# Altium project AIO_3399J_Schematic.PrjPcb (part 1 of 5)
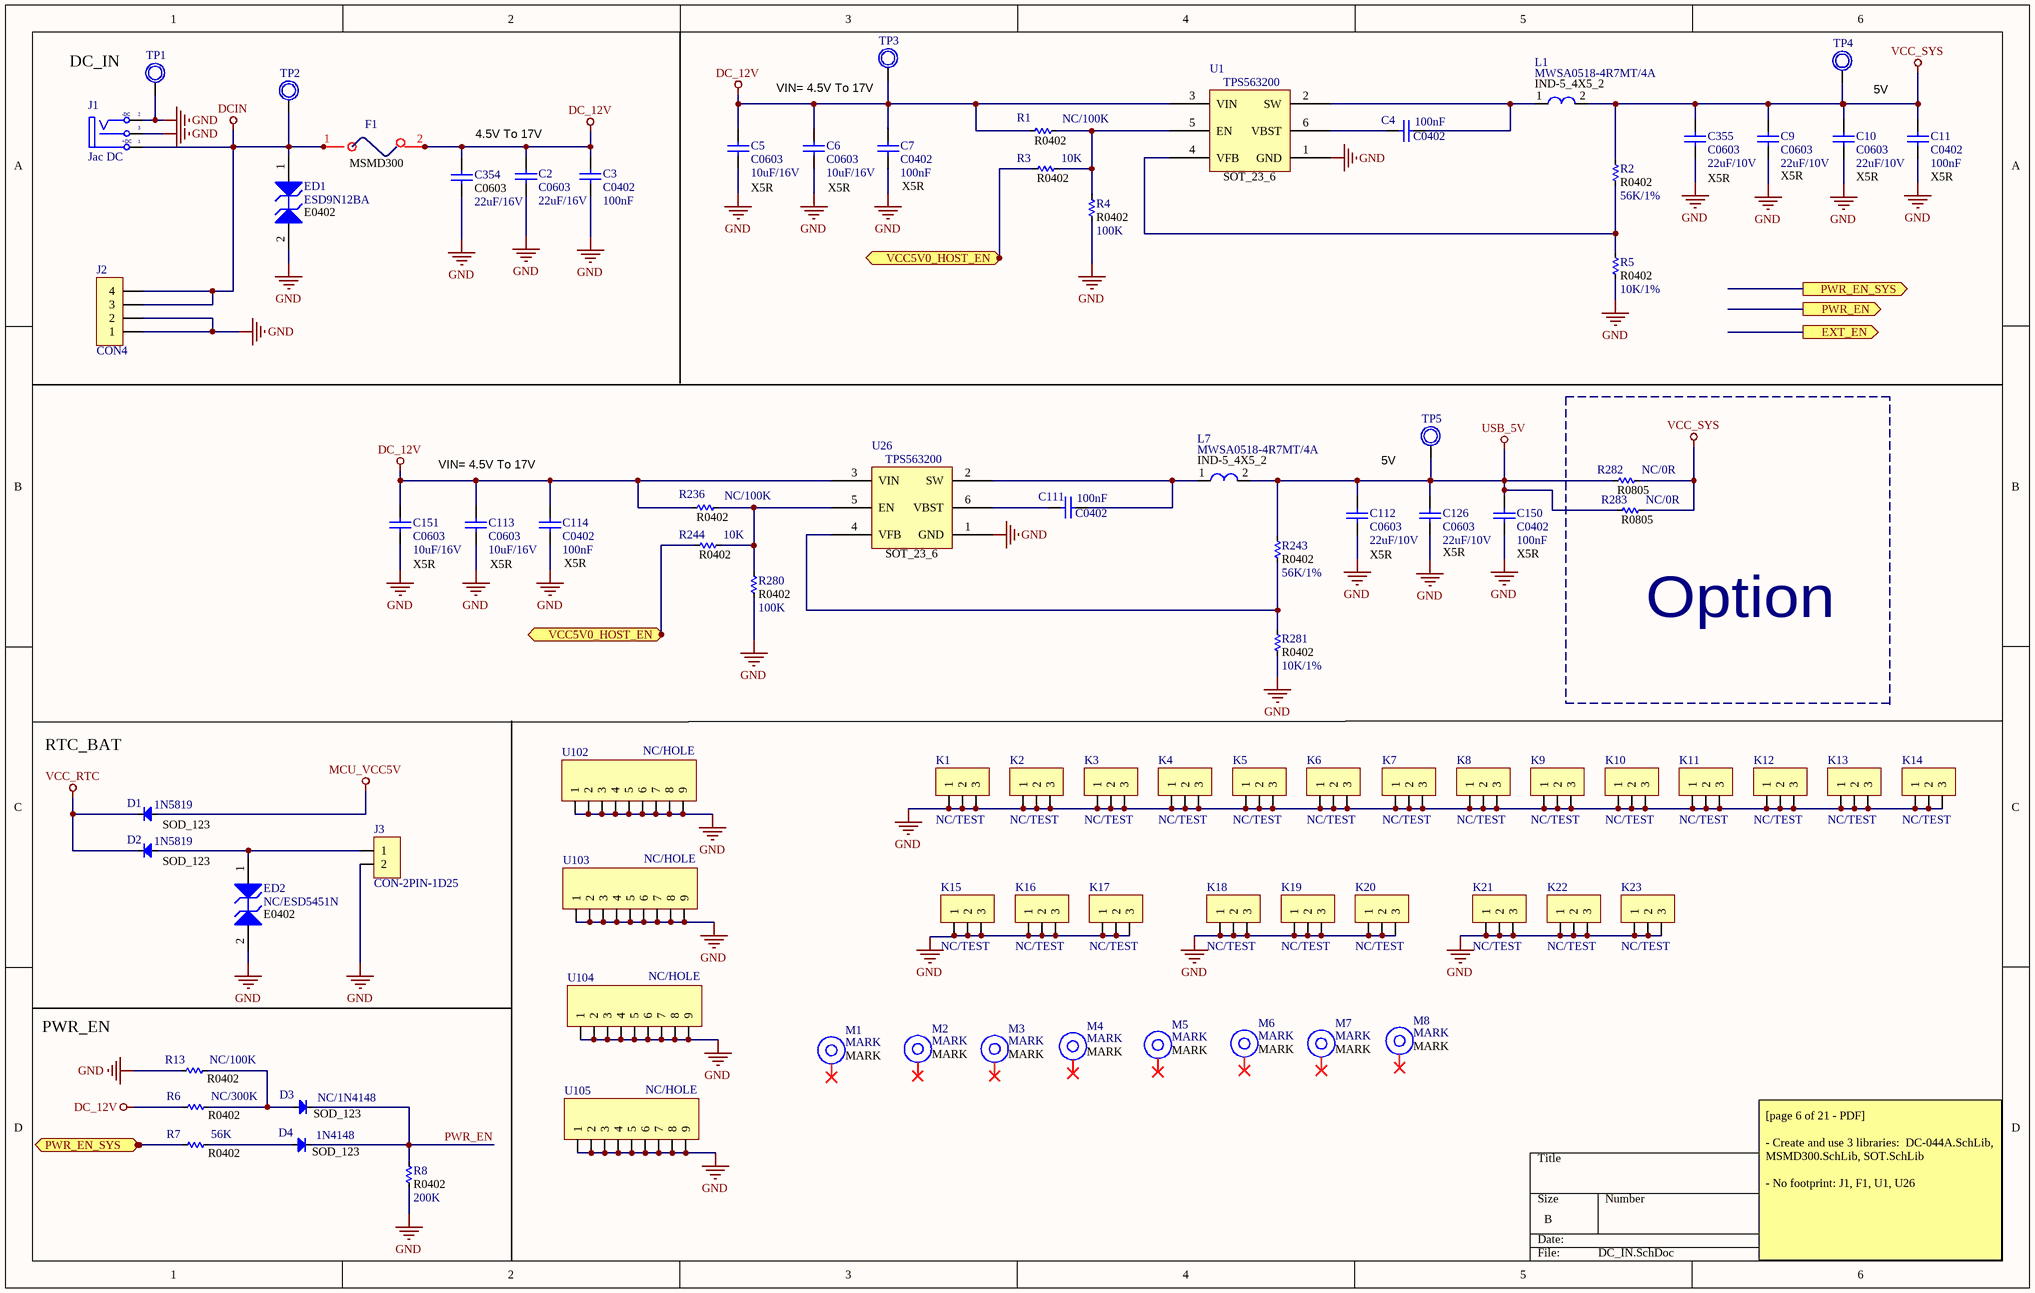
[diagram p0: DC_IN.SchDoc]
16 sheets, 1037 parts. Net scope: flat (ports and power ports of the same name join across sheets).
Board file: PCB1.PcbDoc
Sheets:
  DC_IN.SchDoc
  MCU-TFCARD.SchDoc
  SPI_UART.SchDoc
  MXM_Connector.SchDoc
  MIPI_Panel.SchDoc
  HOST_PORT-USB2.0.SchDoc
  TYPE_CO-USB3.0.SchDoc
  HDMI_OUT.SchDoc
  HDMI_IN.SchDoc
  AUDIO_CODEC.SchDoc
  WIFI.SchDoc
  RJ45.SchDoc
  FAN.SchDoc
  3G4G.SchDoc
  CAMERA.SchDoc
  eDP.SchDoc

## Sheet DC_IN.SchDoc
size B

### Parts
C2  C0603  value 22uF/16V  [C 0603]
C3  C0402  value 100nF  [C 0402]
C4  C0402  value 100nF  [C 0402]
C5  C0603  value 10uF/16V  [C 0603]
C6  C0603  value 10uF/16V  [C 0603]
C7  C0402  value 100nF  [C 0402]
C9  C0603  value 22uF/10V  [C 0603]
C10  C0603  value 22uF/10V  [C 0603]
C11  C0402  value 100nF  [C 0402]
C111  C0402  value 100nF  [C 0402]
C112  C0603  value 22uF/10V  [C 0603]
C113  C0603  value 10uF/16V  [C 0603]
C114  C0402  value 100nF  [C 0402]
C126  C0603  value 22uF/10V  [C 0603]
C150  C0402  value 100nF  [C 0402]
C151  C0603  value 10uF/16V  [C 0603]
C354  C0603  value 22uF/16V  [C 0603]
C355  C0603  value 22uF/10V  [C 0603]
D1  value 1N5819  typr: SOD_123  [DIO-SMD-123]  (hidden comment: Diode SMD)
D2  value 1N5819  typr: SOD_123  [DIO-SMD-123]  (hidden comment: Diode SMD)
D3  value NC/1N4148  typr: SOD_123  [DIO-SMD-123]  (hidden comment: Diode SMD)
D4  value 1N4148  typr: SOD_123  [DIO-SMD-123]  (hidden comment: Diode SMD)
ED1  ESD9N12BA  size: E0402  [DFN1006-2L]
ED2  NC/ESD5451N  size: E0402  [DFN1006-2L]
F1  mSMD300  [MSMD300/3A]  (value not drawn)
J1  Jac DC  [DC-IN]
J2  CON4  [CON4]
J3  CON-2PIN-1D25  [Header2]
K1  NC/TEST  [KTest]
K2  NC/TEST  [KTest]
K3  NC/TEST  [KTest]
K4  NC/TEST  [KTest]
K5  NC/TEST  [KTest]
K6  NC/TEST  [KTest]
K7  NC/TEST  [KTest]
K8  NC/TEST  [KTest]
K9  NC/TEST  [KTest]
K10  NC/TEST  [KTest]
K11  NC/TEST  [KTest]
K12  NC/TEST  [KTest]
K13  NC/TEST  [KTest]
K14  NC/TEST  [KTest]
K15  NC/TEST  [KTest]
K16  NC/TEST  [KTest]
K17  NC/TEST  [KTest]
K18  NC/TEST  [KTest]
K19  NC/TEST  [KTest]
K20  NC/TEST  [KTest]
K21  NC/TEST  [KTest]
K22  NC/TEST  [KTest]
K23  NC/TEST  [KTest]
L1  MWSA0518-4R7MT/4A  [L-SMD-M-7.3x4.5]
L7  MWSA0518-4R7MT/4A  [L-SMD-M-7.3x4.5]
M1  MARK  (value not drawn)
M2  MARK  (value not drawn)
M3  MARK  (value not drawn)
M4  MARK  (value not drawn)
M5  MARK  (value not drawn)
M6  MARK  (value not drawn)
M7  MARK  (value not drawn)
M8  MARK  (value not drawn)
R1  R0402  value NC/100K  [R 0402]
R2  R0402  value 56K/1%  [R 0402]
R3  R0402  value 10K  [R 0402]
R4  R0402  value 100K  [R 0402]
R5  R0402  value 10K/1%  [R 0402]
R6  R0402  value NC/300K  [R 0402]
R7  R0402  value 56K  [R 0402]
R8  R0402  value 200K  [R 0402]
R13  R0402  value NC/100K  [R 0402]
R236  R0402  value NC/100K  [R 0402]
R243  R0402  value 56K/1%  [R 0402]
R244  R0402  value 10K  [R 0402]
R280  R0402  value 100K  [R 0402]
R281  R0402  value 10K/1%  [R 0402]
R282  R0805  value NC/0R  [R 0805]
R283  R0805  value NC/0R  [R 0805]
TP1  TP  [TP1]  (value not drawn)
TP2  TP  [TP1]  (value not drawn)
TP3  TP  [TP1]  (value not drawn)
TP4  TP  [TP1]  (value not drawn)
TP5  TP  [TP1]  (value not drawn)
U1  SOT-23-6_TPS563200  [SOT-23-6]  (value not drawn)
U26  SOT-23-6_TPS563200  [SOT-23-6]  (value not drawn)
U102  NC/HOLE  [JP9-C1T]
U103  NC/HOLE  [JP9-C1T]
U104  NC/HOLE  [JP9-C1T]
U105  NC/HOLE  [JP9-C1T]

### Blocks framed on the sheet
Option: R282 R283

### Ports
EXT_EN (out), PWR_EN (out), PWR_EN_SYS (in), PWR_EN_SYS (out), VCC5V0_HOST_EN (in)

### Nets
DC_12V: C2.2 C3.2 C5.2 C6.2 C7.2 C113.2 C114.2 C151.2 C354.2 F1.2 R1.2 R6.2 R236.2 TP3.1 U1.3(VIN) U26.3(VIN)
DCIN: ED1.1(A1) F1.1 J1.1(T) J2.3 J2.4 TP2.1
GND: C2.1 C3.1 C5.1 C6.1 C7.1 C9.1 C10.1 C11.1 C112.1 C113.1 C114.1 C126.1 C150.1 C151.1 C354.1 C355.1 ED1.2(A2) ED2.2(A2) J1.2(TN) J1.3(S) J2.1 J2.2 J3.2 K1.1 K1.2 K1.3 K2.1 K2.2 K2.3 K3.1 K3.2 K3.3 K4.1 K4.2 K4.3 K5.1 K5.2 K5.3 K6.1 K6.2 K6.3 K7.1 K7.2 K7.3 K8.1 K8.2 K8.3 K9.1 K9.2 K9.3 K10.1 K10.2 K10.3 K11.1 K11.2 K11.3 K12.1 K12.2 K12.3 K13.1 K13.2 K13.3 K14.1 K14.2 K14.3 K15.1 K15.2 K15.3 K16.1 K16.2 K16.3 K17.1 K17.2 K17.3 K18.1 K18.2 K18.3 K19.1 K19.2 K19.3 K20.1 K20.2 K20.3 K21.1 K21.2 K21.3 K22.1 K22.2 K22.3 K23.1 K23.2 K23.3 R4.1 R5.2 R8.2 R13.2 R280.1 R281.2 TP1.1 U1.1(GND) U26.1(GND) U102.1 U102.2 U102.3 U102.4 U102.5 U102.6 U102.7 U102.8 U102.9 U103.1 U103.2 U103.3 U103.4 U103.5 U103.6 U103.7 U103.8 U103.9 U104.1 U104.2 U104.3 U104.4 U104.5 U104.6 U104.7 U104.8 U104.9 U105.1 U105.2 U105.3 U105.4 U105.5 U105.6 U105.7 U105.8 U105.9
MCU_VCC5V: D1.1(A)
USB_5V: C112.2 C126.2 C150.2 L7.2 R243.2 R282.2 R283.2 TP5.1
VCC_RTC: D1.2(K) D2.2(K)
VCC_SYS: C9.2 C10.2 C11.2 C355.2 L1.2 R2.2 R282.1 R283.1 TP4.1
PWR_EN: D3.2(K) D4.2(K) R8.1
NetC4_1: C4.1 L1.1 U1.2(SW)
NetC4_2: C4.2 U1.6(VBST)
NetC111_1: C111.1 L7.1 U26.2(SW)
NetC111_2: C111.2 U26.6(VBST)
NetD2_1: D2.1(A) ED2.1(A1) J3.1
NetD3_1: D3.1(A) R6.1 R13.1
NetD4_1: D4.1(A) R7.1
NetR1_1: R1.1 R3.1 R4.2 U1.5(EN)
NetR2_1: R2.1 R5.1 U1.4(VFB)
NetR7_2: R7.2 ; port PWR_EN_SYS
NetR236_1: R236.1 R244.1 R280.2 U26.5(EN)
NetR243_1: R243.1 R281.1 U26.4(VFB)

Not connected (* = marked no-connect by the designer): M1 52*; M2 52*; M3 52*; M4 52*; M5 52*; M6 52*; M7 52*; M8 52*; R3 2; R244 2

### Notes on the sheet
- (near TP1) DC_IN
- (near TP3) VIN= 4.5V To 17V
- 5V
- 4.5V To 17V
- VIN= 4.5V To 17V
- (near TP5) 5V
- (near D1) RTC_BAT
- (near R13) PWR_EN
- [page 6 of 21 - PDF]
  - Create and use 3 libraries:  DC-044A.SchLib, MSMD300.SchLib, SOT.SchLib
  - No footprint: J1, F1, U1, U26
- (in symbol Cap) X5R
- (in symbol DCIN) -DC; +DC
- (in symbol L-SMD-1) IND-5_4X5_2
- (in symbol mSMD300) MSMD300
- (in symbol SOT-23-6_TPS563200) SOT_23_6

### Library data of the parts
C2-C7 C9-C11 C111-C114 C126 C150 C151 C354 C355 = Cap: Capacitor; Published: 8-Jun-2000; LatestRevisionDate: 17-Jul-2002; LatestRevisionNote: Re-released for DXP Platform.; PackageReference: RAD-0.3; Publisher: Altium Limited; PackageDescription: Radial Cap, Thru-Hole; 2 Leads; 0.3 in Pin Spacing
D1-D4 = Diode SMD: Default Diode; Code - JEDEC: DO-214-AB; Published: 8-Jun-2000; Revision: July-2002: Re-released for DXP Platform.; Publisher: Altium Limited
ED1 ED2 = 1SMB54CAT3: 600 W Peak Power Zener Transient Voltage Suppressor, Bidirectional, 2-Pin SMB, Tape and Reel; Manufacturer: On Semiconductor; IR Max (uA): 5; PPK Max (W): 600; V(BR) Typ (V): 63.16; DatasheetVersion: Rev. A; PackageVersion: Rev. A, 01/2000; PackageReference: SMB-2-403C-01; PackageDescription: 2-Pin Small Molded Package, J-Bend Lead, Body 4.315 x 3.555 mm; Supplier 1: Digi-Key; Supplier Part Number 1: 1SMB54CAT3-ND; Direction: Bidirectional; Packing: Tape and Reel; Mounting Technology: Surface Mount; PartNumber: 1SMB54CAT3; ComponentLink1Description: Manufacturer URL; ComponentLink1URL: http://www.onsemi.com/; ComponentLink2Description: Datasheet; ComponentLink2URL: http://www.onsemi.com/pub_link/Collateral/1SMB10CAT3-D.PDF; ComponentLink3Description: Package Specification; ComponentLink3URL: http://www.onsemi.com/pub_link/Collateral/1SMB10CAT3-D.PDF
J1 = DCIN: Jac DC input; Value: Jac DC
J2 = JP4x1-2.0: WR-PHD 2.00 mm Socket Header; Manufacturer: W¨¹rth Elektronik eiSos GmbH; partNo: 62000411821; ComponentLink1 Description: Manufacturer; ComponentLink2 Description: Datasheet; NoPins: 04; Created Date: 2 April 2013; ComponentLink1URL: http://www.we-online.com; ComponentLink2URL: http://katalog.we-online.de/em/datasheet/6200xx11821.pdf; Created by: Karrer Zheng
J3 = JP2: WR-PHD 2.54 mm Angled Socket Header; Manufacturer: W¨¹rth Elektronik eiSos GmbH; partNo: 613002143121; ComponentLink1 Description: Manufacturer; ComponentLink2 Description: Datasheet; NoPins: 02; Created Date: 29 March 2013; ComponentLink1URL: http://www.we-online.com; ComponentLink2URL: http://katalog.we-online.de/em/datasheet/6130xx143121.pdf; Created by: Karrer Zheng
K1-K23 = JP3: WR-PHD 2.54 mm Angled Socket Header; Manufacturer: W¨¹rth Elektronik eiSos GmbH; partNo: 613003143121; ComponentLink1 Description: Manufacturer; ComponentLink2 Description: Datasheet; NoPins: 03; Created Date: 29 March 2013; ComponentLink1URL: http://www.we-online.com; ComponentLink2URL: http://katalog.we-online.de/em/datasheet/6130xx143121.pdf; Created by: Karrer Zheng
L1 L7 = L-SMD-1: partNo: 78477010; Manufacturer: Wurth Elektronik; Inductance: 1.0 μH; ComponentLink1Description: Manufacturer; ComponentLink1URL: http://www.we-online.de; Created by: Baojun Chen; Created Date: Nov.2015; ComponentLink2Description: Datasheet; ComponentLink2URL: http://katalog.we-online.de/pbs/datasheet/78477010.pdf
R1-R8 R13 R236 R243 R244 R280-R283 = Res-SMD: Resistor; Manufacturer: Generic Components; Class: Passive; Published: 08/06/2000; Publisher: Altium Hobart Technology Centre
TP1-TP5 = TP1: Test Point; Value: Test Point
U1 U26 = SOT-23-6_TPS563200: Switching Voltage Regulators 17 Vin,3A Sync SD Reg; Manufacturer: Texas Instruments; Manufacturer Part Number: TPS563200DDCR; Operating Supply Current: 190 uA; Supplier 1: Mouser; RoHS: RoHS Compliant; Category: Switching Voltage Regulators; Stock 1: 18637; Pricing 1: 1=1.44, 10=1.23, 100=0.947, 500=0.836, 1000=0.660, 3000=0.586, 9000=0.564 (USD); Height: 1.1 mm; Length: 2.9 mm; Operating Temperature Range: - 40 C to + 125 C; Package / Case: SOT-23-Thin-6; Packaging: Cut Tape; Series: TPS563200; Width: 1.6 mm; Brand: Texas Instruments; Mounting Style: SMD/SMT; Maximum Operating Temperature: + 125 C; Minimum Operating Temperature: - 40 C; Product Type: Switching Voltage Regulators; Standard Pack Qty: 3000; Subcategory: PMIC - Power Management ICs; RoHS - Mouser: Y; Minimum Order Quantity: 1; Reeling: True
U102-U105 = JP9: WR-PHD 2.54 mm Angled Socket Header; Manufacturer: W¨¹rth Elektronik eiSos GmbH; partNo: 613009143121; ComponentLink1 Description: Manufacturer; ComponentLink2 Description: Datasheet; NoPins: 09; Created Date: 29 March 2013; ComponentLink1URL: http://www.we-online.com; ComponentLink2URL: http://katalog.we-online.de/em/datasheet/6130xx143121.pdf; Created by: Karrer Zheng

## Sheet MCU-TFCARD.SchDoc
size B
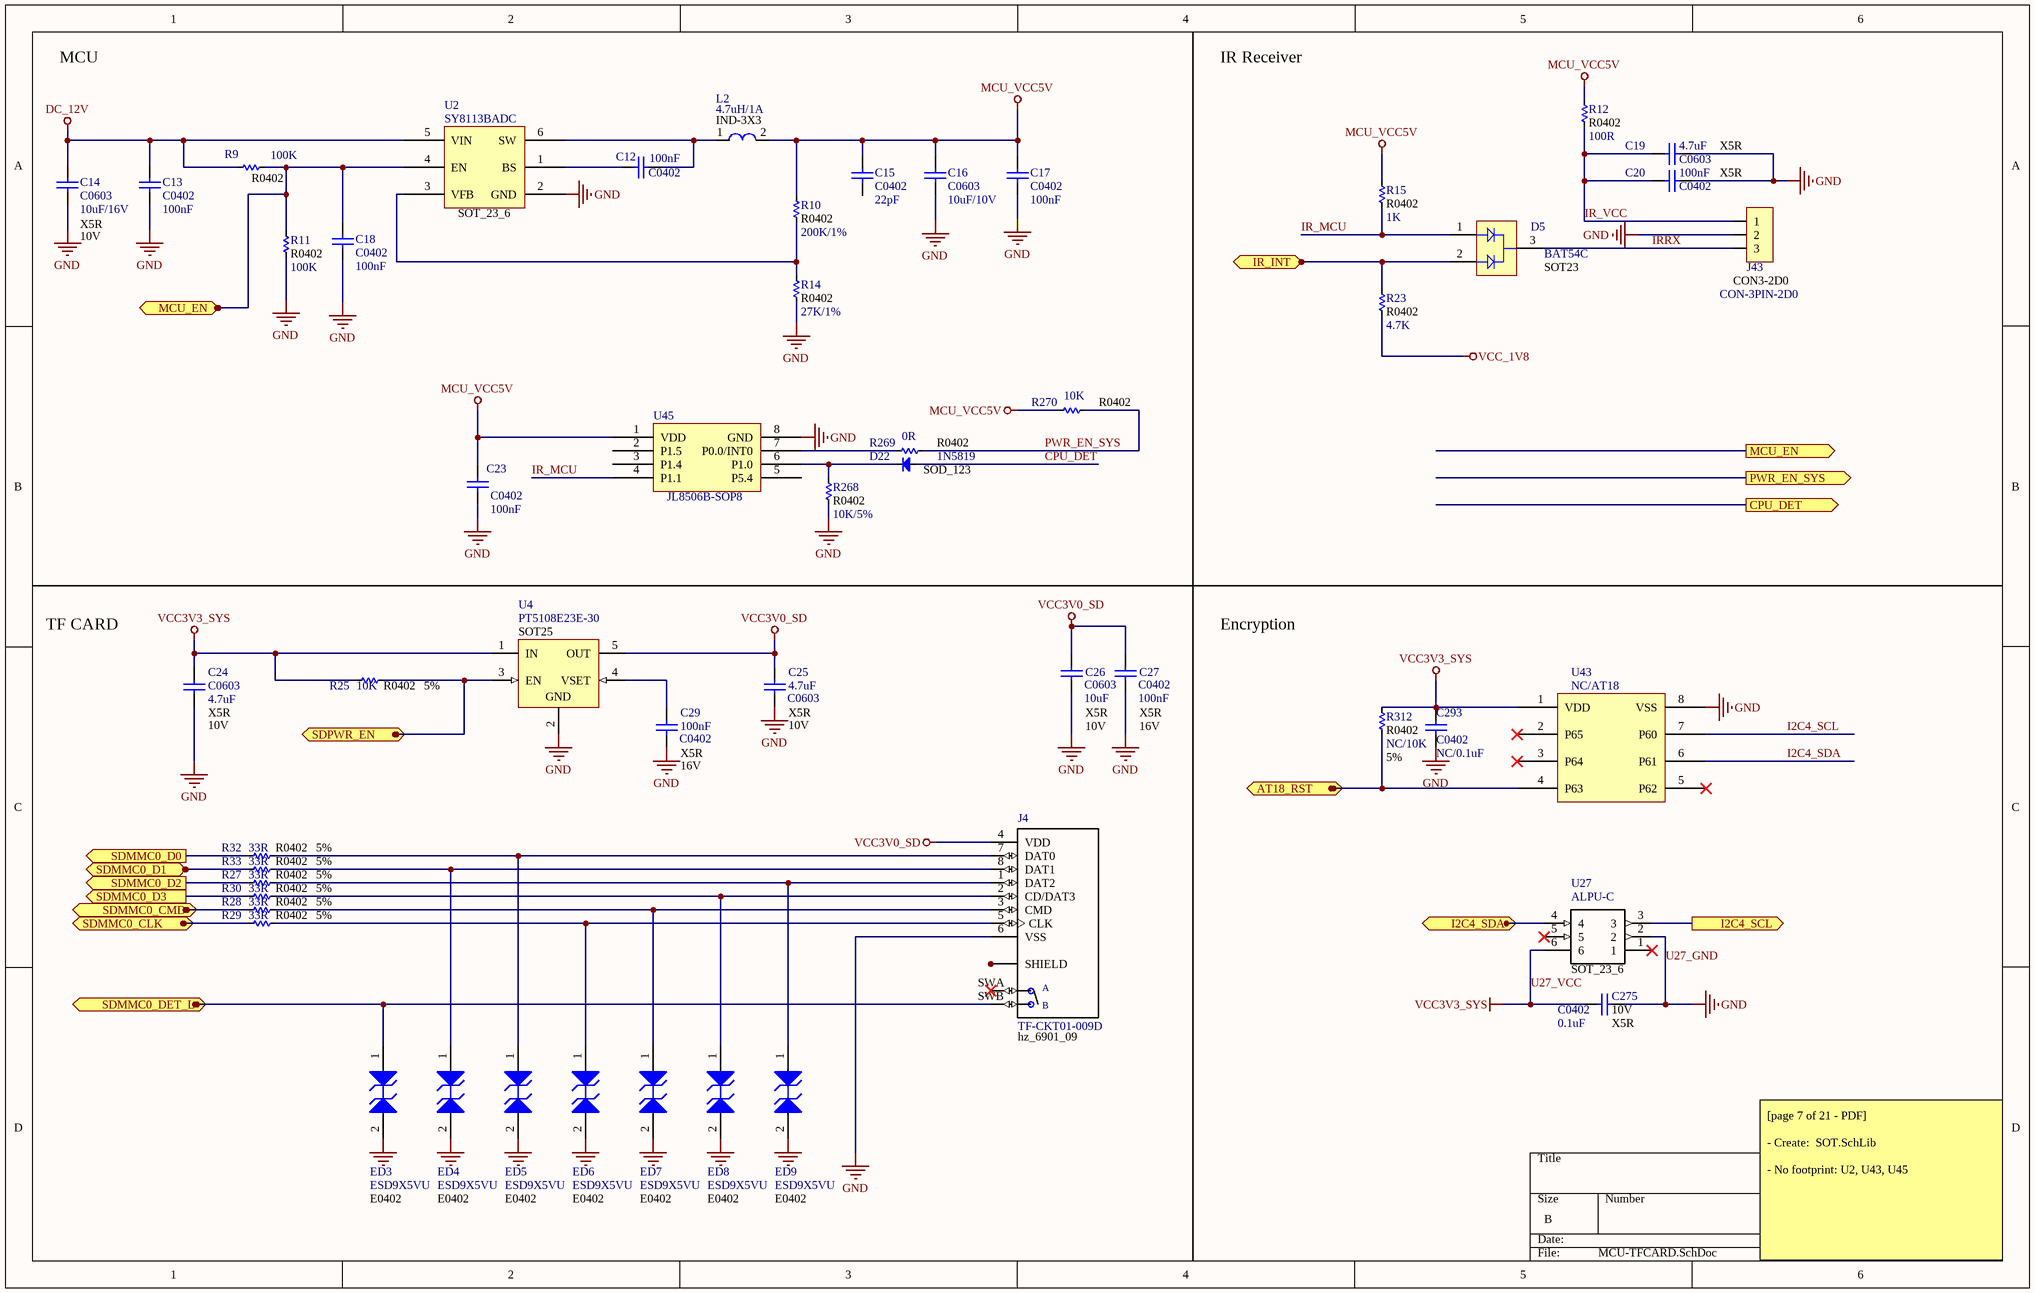
[diagram p1: MCU-TFCARD.SchDoc]

### Parts
C12  C0402  value 100nF  [C 0402]
C13  C0402  value 100nF  [C 0402]
C14  C0603  value 10uF/16V  [C 0603]
C15  C0402  value 22pF  [C 0402]
C16  C0603  value 10uF/10V  [C 0603]
C17  C0402  value 100nF  [C 0402]
C18  C0402  value 100nF  [C 0402]
C19  C0603  value 4.7uF  [C 0603]
C20  C0402  value 100nF  [C 0402]
C23  C0402  value 100nF  [C 0402]
C24  C0603  value 4.7uF  [C 0603]
C25  C0603  value 4.7uF  [C 0603]
C26  C0603  value 10uF  [C 0603]
C27  C0402  value 100nF  [C 0402]
C29  C0402  value 100nF  [C 0402]
C275  C0402  value 0.1uF  [C 0402]
C293  C0402  value NC/0.1uF  [C 0402]
D5  BAT54C  [INF-SOT23_N]
D22  value 1N5819  typr: SOD_123  [DIO-SMD-123]  (hidden comment: Diode SMD)
ED3  ESD9X5VU  size: E0402  [DFN1006-2L]
ED4  ESD9X5VU  size: E0402  [DFN1006-2L]
ED5  ESD9X5VU  size: E0402  [DFN1006-2L]
ED6  ESD9X5VU  size: E0402  [DFN1006-2L]
ED7  ESD9X5VU  size: E0402  [DFN1006-2L]
ED8  ESD9X5VU  size: E0402  [DFN1006-2L]
ED9  ESD9X5VU  size: E0402  [DFN1006-2L]
J4  TF-CKT01-009D  [*HRS_DM3AT-SF-PEJM5_DM3AT-SF-PEJM5(Primary)]
J43  CON-3PIN-2D0  [CON3]
L2  4.7uH/1A  [L-SMD-M-7.3x4.5]
R9  R0402  value 100K  [R 0402]
R10  R0402  value 200K/1%  [R 0402]
R11  R0402  value 100K  [R 0402]
R12  R0402  value 100R  [R 0402]
R14  R0402  value 27K/1%  [R 0402]
R15  R0402  value 1K  [R 0402]
R23  R0402  value 4.7K  [R 0402]
R25  R0402  value 10K  [R 0402]
R27  R0402  value 33R  [R 0402]
R28  R0402  value 33R  [R 0402]
R29  R0402  value 33R  [R 0402]
R30  R0402  value 33R  [R 0402]
R32  R0402  value 33R  [R 0402]
R33  R0402  value 33R  [R 0402]
R268  R0402  value 10K/5%  [R 0402]
R269  R0402  value 0R  [R 0402]
R270  R0402  value 10K  [R 0402]
R312  R0402  value NC/10K  [R 0402]
U2  SOT-23-6_SY8113BADC  [SOT-23-6 Thin]  (value not drawn)
U4  PT5108E23E-30  [TI-DDC5_N]
U27  ALPU-C  [*SSOT6]
U43  NC/AT18  [SOP-8]
U45  SOP-8_JL8506B  [SOP-8]  (value not drawn)

### Ports
AT18_RST (in), CPU_DET (out), I2C4_SCL (out), I2C4_SDA (out), IR_INT (out), MCU_EN (in), MCU_EN (out), PWR_EN_SYS (out), SDMMC0_CLK (out), SDMMC0_CMD (out), SDMMC0_D0 (out), SDMMC0_D1 (out), SDMMC0_D2 (out), SDMMC0_D3 (out), SDMMC0_DET_L (out), SDPWR_EN (in)

### Nets
DC_12V: C13.2 C14.2 R9.2 U2.5(VIN)
GND: C13.1 C14.1 C16.1 C17.1 C18.1 C19.1 C20.1 C23.1 C24.1 C25.1 C26.1 C27.1 C29.1 C275.2 C293.1 ED3.2(A2) ED4.2(A2) ED5.2(A2) ED6.2(A2) ED7.2(A2) ED8.2(A2) ED9.2(A2) J4.6(VSS) J43.2 R11.1 R14.2 R268.2 U2.2(GND) U4.2(GND) U27.2 U43.8(VSS) U45.8(GND)  [also labelled U27_GND]
MCU_VCC5V: C15.2 C16.2 C17.2 C23.2 L2.2 R10.2 R12.1 R15.1 R270.1 U45.1(VDD)
U27_VCC: C24.2 C275.1 C293.2 R25.1 R312.2 U4.1(IN) U27.6 U43.1(VDD)  [also labelled VCC3V3_SYS]
VCC3V0_SD: C25.2 C26.2 C27.2 J4.4(VDD) U4.5(OUT)
VCC_1V8: R23.2
CPU_DET: D22.1(A)
I2C4_SCL: U27.3 ; port I2C4_SCL
I2C4_SCL: U43.7(P60)  [a separate net that carries the same name]
I2C4_SDA: U27.4 ; port I2C4_SDA
I2C4_SDA: U43.6(P61)  [a separate net that carries the same name]
IR_INT: D5.2(A2) R23.1 ; port IR_INT
IR_MCU: D5.1(A1) R15.2 U45.4(P1.1)
IR_VCC: C19.2 C20.2 J43.1 R12.2
IRRX: D5.3(K) J43.3
PWR_EN_SYS: R269.2 R270.2
SDMMC0_CLK: R29.1 ; port SDMMC0_CLK
SDMMC0_CMD: R28.1 ; port SDMMC0_CMD
SDMMC0_D0: R32.1 ; port SDMMC0_D0
SDMMC0_D1: R33.1 ; port SDMMC0_D1
SDMMC0_D2: R27.1 ; port SDMMC0_D2
SDMMC0_D3: R30.1 ; port SDMMC0_D3
SDMMC0_DET_L: ED3.1(A1) J4.SWB(B) ; port SDMMC0_DET_L
NetC12_1: C12.1 L2.1 U2.6(SW)
NetC12_2: C12.2 U2.1(BS)
NetC18_2: C18.2 R9.1 R11.2 U2.4(EN) ; port MCU_EN
NetC29_2: C29.2 U4.4(VSET)
NetD22_2: D22.2(K) R268.1 U45.6(P1.0)
NetED4_1: ED4.1(A1) J4.8(DAT1) R33.2
NetED5_1: ED5.1(A1) J4.7(DAT0) R32.2
NetED6_1: ED6.1(A1) J4.5(CLK) R29.2
NetED7_1: ED7.1(A1) J4.3(CMD) R28.2
NetED8_1: ED8.1(A1) J4.2(CD/DAT3) R30.2
NetED9_1: ED9.1(A1) J4.1(DAT2) R27.2
NetJ4_P1: J4.P1(SHIELD) J4.P2(SHIELD) J4.P3(SHIELD) J4.P4(SHIELD)
NetJ38_65: R312.1 U43.4(P63) ; port AT18_RST
NetJ38_165: R25.2 U4.3(EN) ; port SDPWR_EN
NetR10_1: R10.1 R14.1 U2.3(VFB)
NetR269_1: R269.1 U45.7(P0.0/INT0)

Not connected (* = marked no-connect by the designer): C15 1; J4 SWA(A)*; U27 1* 5*; U43 2(P65)* 3(P64)* 5(P62)*; U45 2(P1.5) 3(P1.4) 5(P5.4)

### Notes on the sheet
- MCU
- IR Receiver
- TF CARD
- Encryption
- [page 7 of 21 - PDF]
  - Create:  SOT.SchLib
  - No footprint: U2, U43, U45
- (in symbol Cap) X5R; 10V; 16V
- (in symbol DM3AT-SF-PEJM5) hz_6901_09
- (in symbol FDC6331L) SOT_23_6
- (in symbol JP3) CON3-2D0
- (in symbol L-SMD-1) IND-3X3
- (in symbol Res-SMD) 5%
- (in symbol SOP-8_JL8506B) JL8506B-SOP8
- (in symbol SOT-23-6_SY8113BADC) SY8113BADC; SOT_23_6
- (in symbol TPS781330220DDCTG4) SOT25

### Library data of the parts
C12-C20 C23-C27 C29 C275 C293 = Cap: Capacitor; Published: 8-Jun-2000; LatestRevisionDate: 17-Jul-2002; LatestRevisionNote: Re-released for DXP Platform.; PackageReference: RAD-0.3; Publisher: Altium Limited; PackageDescription: Radial Cap, Thru-Hole; 2 Leads; 0.3 in Pin Spacing
D5 = BAT54-05: Silicon Schottky Diode, SOT23, Reel, Green; Manufacturer: Infineon; Configuration: Dual; CT (max): 10 pF; Green: TRUE; IF (max): 200 mA; VF (max): 800 mV; VR (max): 30 V; PackageVersion: Apr-08; PackageReference: SOT23; PackageDescription: 3-Pin Small Outline Transistor Package, 1.3 x 2.9 mm Body, 0.95 mm Pitch; Supplier 1: Mouser; Supplier Part Number 1: N/A; Packing: Reel; Mounting Technology: Surface Mount; PartNumber: BAT54-05; ComponentLink1Description: Manufacturer URL; ComponentLink1URL: http://www.infineon.com/; ComponentLink2Description: Datasheet; ComponentLink2URL: http://www.infineon.com/dgdl/bat54series.pdf?folderId=db3a30431400ef68011425f1ca2505e3&fileId=db3a304314dca3890115190b74210ea6; ComponentLink3Description: Package Specification; ComponentLink3URL: http://www.infineon.com/dgdl/SOT23-Package_Overview.pdf?folderId=db3a30431936bc4b0119532290053c66&fileId=db3a30431936bc4b0119533468123c85
D22 = Diode SMD: Default Diode; Code - JEDEC: DO-214-AB; Published: 8-Jun-2000; Revision: July-2002: Re-released for DXP Platform.; Publisher: Altium Limited
ED3-ED9 = 1SMB54CAT3: as ED1 on sheet DC_IN; DatasheetVersion: Rev. A; PackageVersion: Rev. A, 01/2000; PackageReference: SMB-2-403C-01; PackageDescription: 2-Pin Small Molded Package, J-Bend Lead, Body 4.315 x 3.555 mm; Supplier 1: Digi-Key; Supplier Part Number 1: 1SMB54CAT3-ND; Direction: Bidirectional; Packing: Tape and Reel; Mounting Technology: Surface Mount; PartNumber: 1SMB54CAT3; ComponentLink1Description: Manufacturer URL; ComponentLink1URL: http://www.onsemi.com/; ComponentLink2Description: Datasheet; ComponentLink2URL: http://www.onsemi.com/pub_link/Collateral/1SMB10CAT3-D.PDF; ComponentLink3Description: Package Specification; ComponentLink3URL: http://www.onsemi.com/pub_link/Collateral/1SMB10CAT3-D.PDF
J4 = DM3AT-SF-PEJM5: DM3 RA SMT microSD memory card push/push; MF: Hirose; SnapEDA_Link: https://www.snapeda.com/parts/DM3AT-SF-PEJM5/Hirose%20Electric%20Co%20Ltd/view-part/?ref=snap; MP: DM3AT-SF-PEJM5; Package: None; Price: None; Availability: Unavailable; Value: *
J43 = JP3: as K1 on sheet DC_IN; Created Date: 29 March 2013; ComponentLink1URL: http://www.we-online.com; ComponentLink2URL: http://katalog.we-online.de/em/datasheet/6130xx143121.pdf; Created by: Karrer Zheng
L2 = L-SMD-1: as L1 on sheet DC_IN; ComponentLink1Description: Manufacturer; ComponentLink1URL: http://www.we-online.de; Created by: Baojun Chen; Created Date: Nov.2015; ComponentLink2Description: Datasheet; ComponentLink2URL: http://katalog.we-online.de/pbs/datasheet/78477010.pdf
R9-R12 R14 R15 R23 R25 R27-R30 R32 R33 R268-R270 R312 = Res-SMD: as R1 on sheet DC_IN; Published: 08/06/2000; Publisher: Altium Hobart Technology Centre
U2 = SOT-23-6_SY8113BADC: Switching Voltage Regulators 17 Vin,3A Sync SD Reg; Manufacturer: Texas Instruments; Manufacturer Part Number: TPS563200DDCR; Operating Supply Current: 190 uA; Supplier 1: Mouser; RoHS: RoHS Compliant; Category: Switching Voltage Regulators; Stock 1: 18637; Pricing 1: 1=1.44, 10=1.23, 100=0.947, 500=0.836, 1000=0.660, 3000=0.586, 9000=0.564 (USD); Height: 1.1 mm; Length: 2.9 mm; Operating Temperature Range: - 40 C to + 125 C; Package / Case: SOT-23-Thin-6; Packaging: Cut Tape; Series: TPS563200; Width: 1.6 mm; Brand: Texas Instruments; Mounting Style: SMD/SMT; Maximum Operating Temperature: + 125 C; Minimum Operating Temperature: - 40 C; Product Type: Switching Voltage Regulators; Standard Pack Qty: 3000; Subcategory: PMIC - Power Management ICs; RoHS - Mouser: Y; Minimum Order Quantity: 1; Reeling: True
U4 = TPS781330220DDCTG4: Single Output Dual Level Fixed LDO, 150 mA, Fixed 2.2, 3.3 V Output, 2.2 to 5.5 V Input, with Vset Pin, 5-pin SOT (DDC), -40 to 125 degC, Green (RoHS & no Sb/Br); Manufacturer: Texas Instruments; Accuracy(%): 3; Fixed Output Options(V): 3.3; Iout(Max)(A): 0.15; Iq(Typ)(mA): 0.001; SubFamily: Single Channel LDO; Vdo(Typ)(mV): 200; Vin(Max)(V): 5.5; Vin(Min)(V): 2.2; DatasheetVersion: SBVS102B; PackageVersion: 4204403-2/E; PackageReference: DDC5; PackageDescription: 5-Pin Plastic Small Outline, Body 2.9 x 1.6 mm, 0.95 mm Pitch; Supplier 1: Digi-Key; Supplier Part Number 1: TPS781330220DDCTG4-ND; Supplier 2: Mouser; Supplier Part Number 2: 595-S781330220DDCTG4; Eco-Plan: Green (RoHS & no Sb/Br); Vout Adj(Max)(V): 3.3; Vout Adj(Min)(V): 3.3; Mounting Technology: Surface Mount; Code_JEDEC: MO-193; PartNumber: TPS781330220DDCTG4; ComponentLink1Description: Manufacturer URL; ComponentLink1URL: http://www.ti.com/; ComponentLink2Description: Datasheet; ComponentLink2URL: http://www.ti.com/general/docs/lit/getliterature.tsp?genericPartNumber=TPS781330220&fileType=pdf; ComponentLink3Description: Package Specification; ComponentLink3URL: http://www.ti.com/litv/pdf/mpds123d
U27 = FDC6331L: FDC6331 Series 8 V 2.8 A High Side Integrated Load Switch - SSOT-6; MF: ON Semiconductor; Availability: Unavailable; Package: TSOT-23-6 ON Semiconductor; Price: None; SnapEDA_Link: https://www.snapeda.com/parts/FDC6331L/ON%20Semiconductor/view-part/?ref=snap; MP: FDC6331L; Value: *
U43 = SOP8_AT18

## Sheet SPI_UART.SchDoc
size C
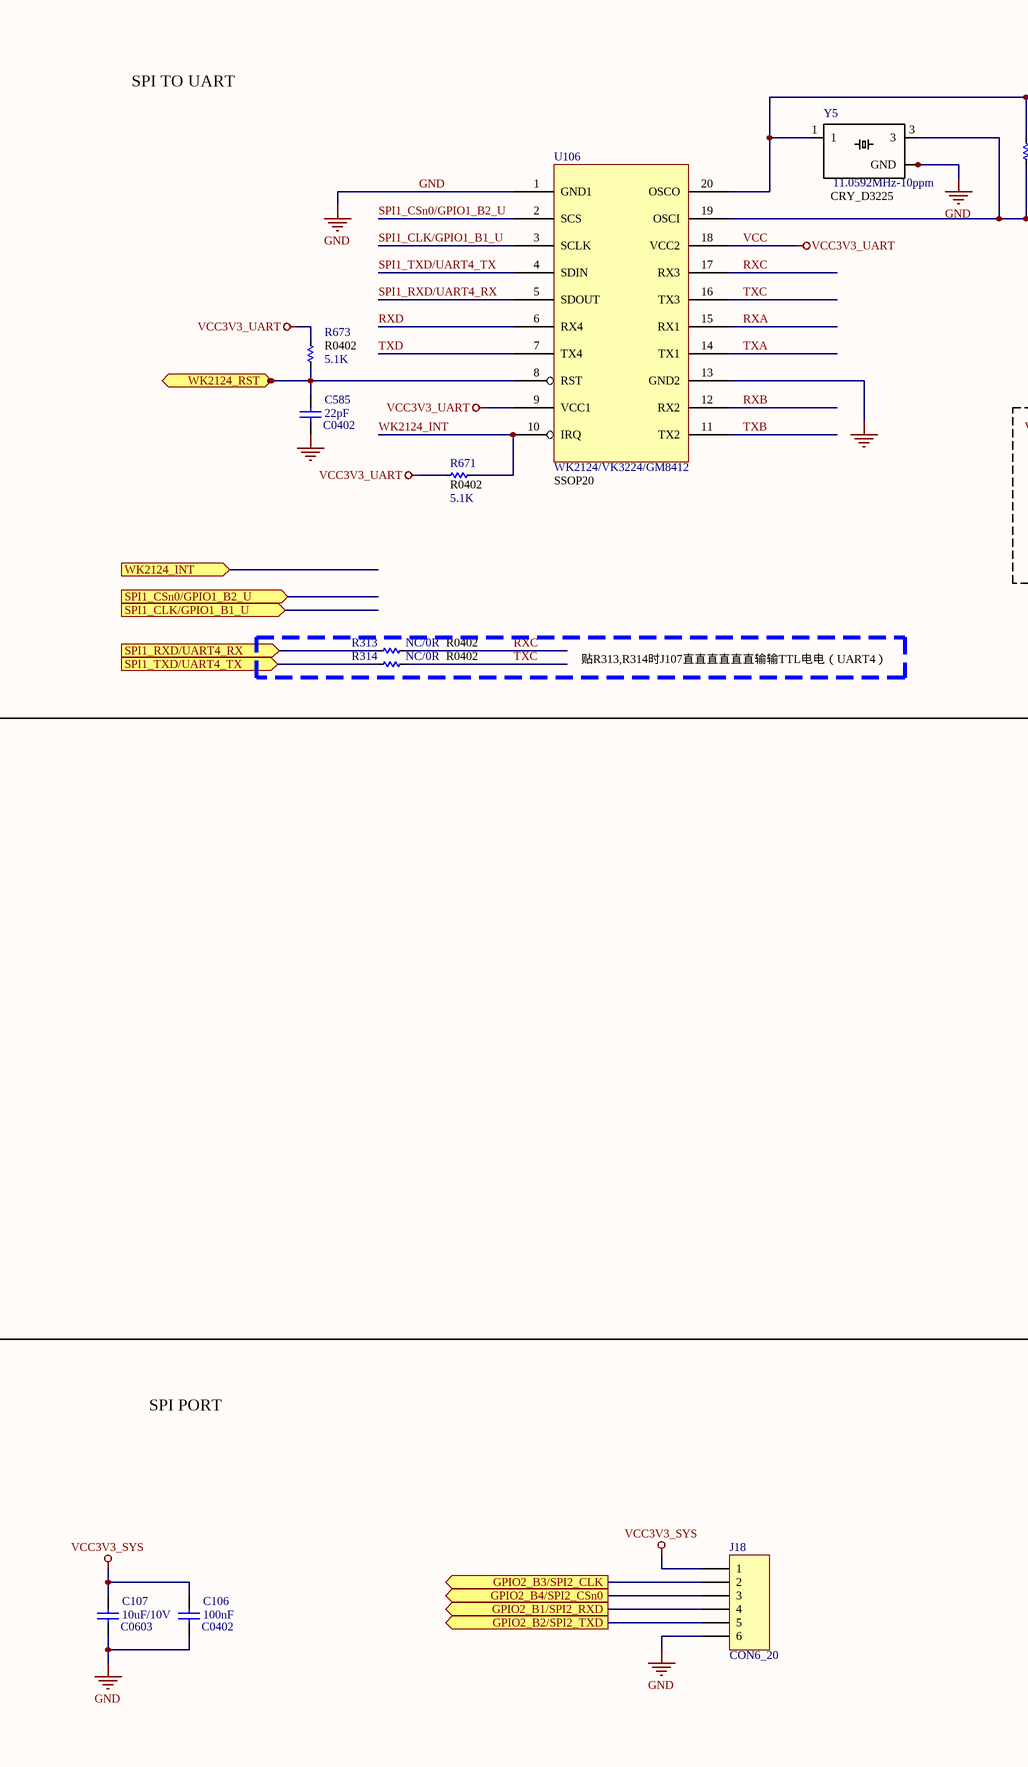
[diagram p2: SPI_UART.SchDoc, left]
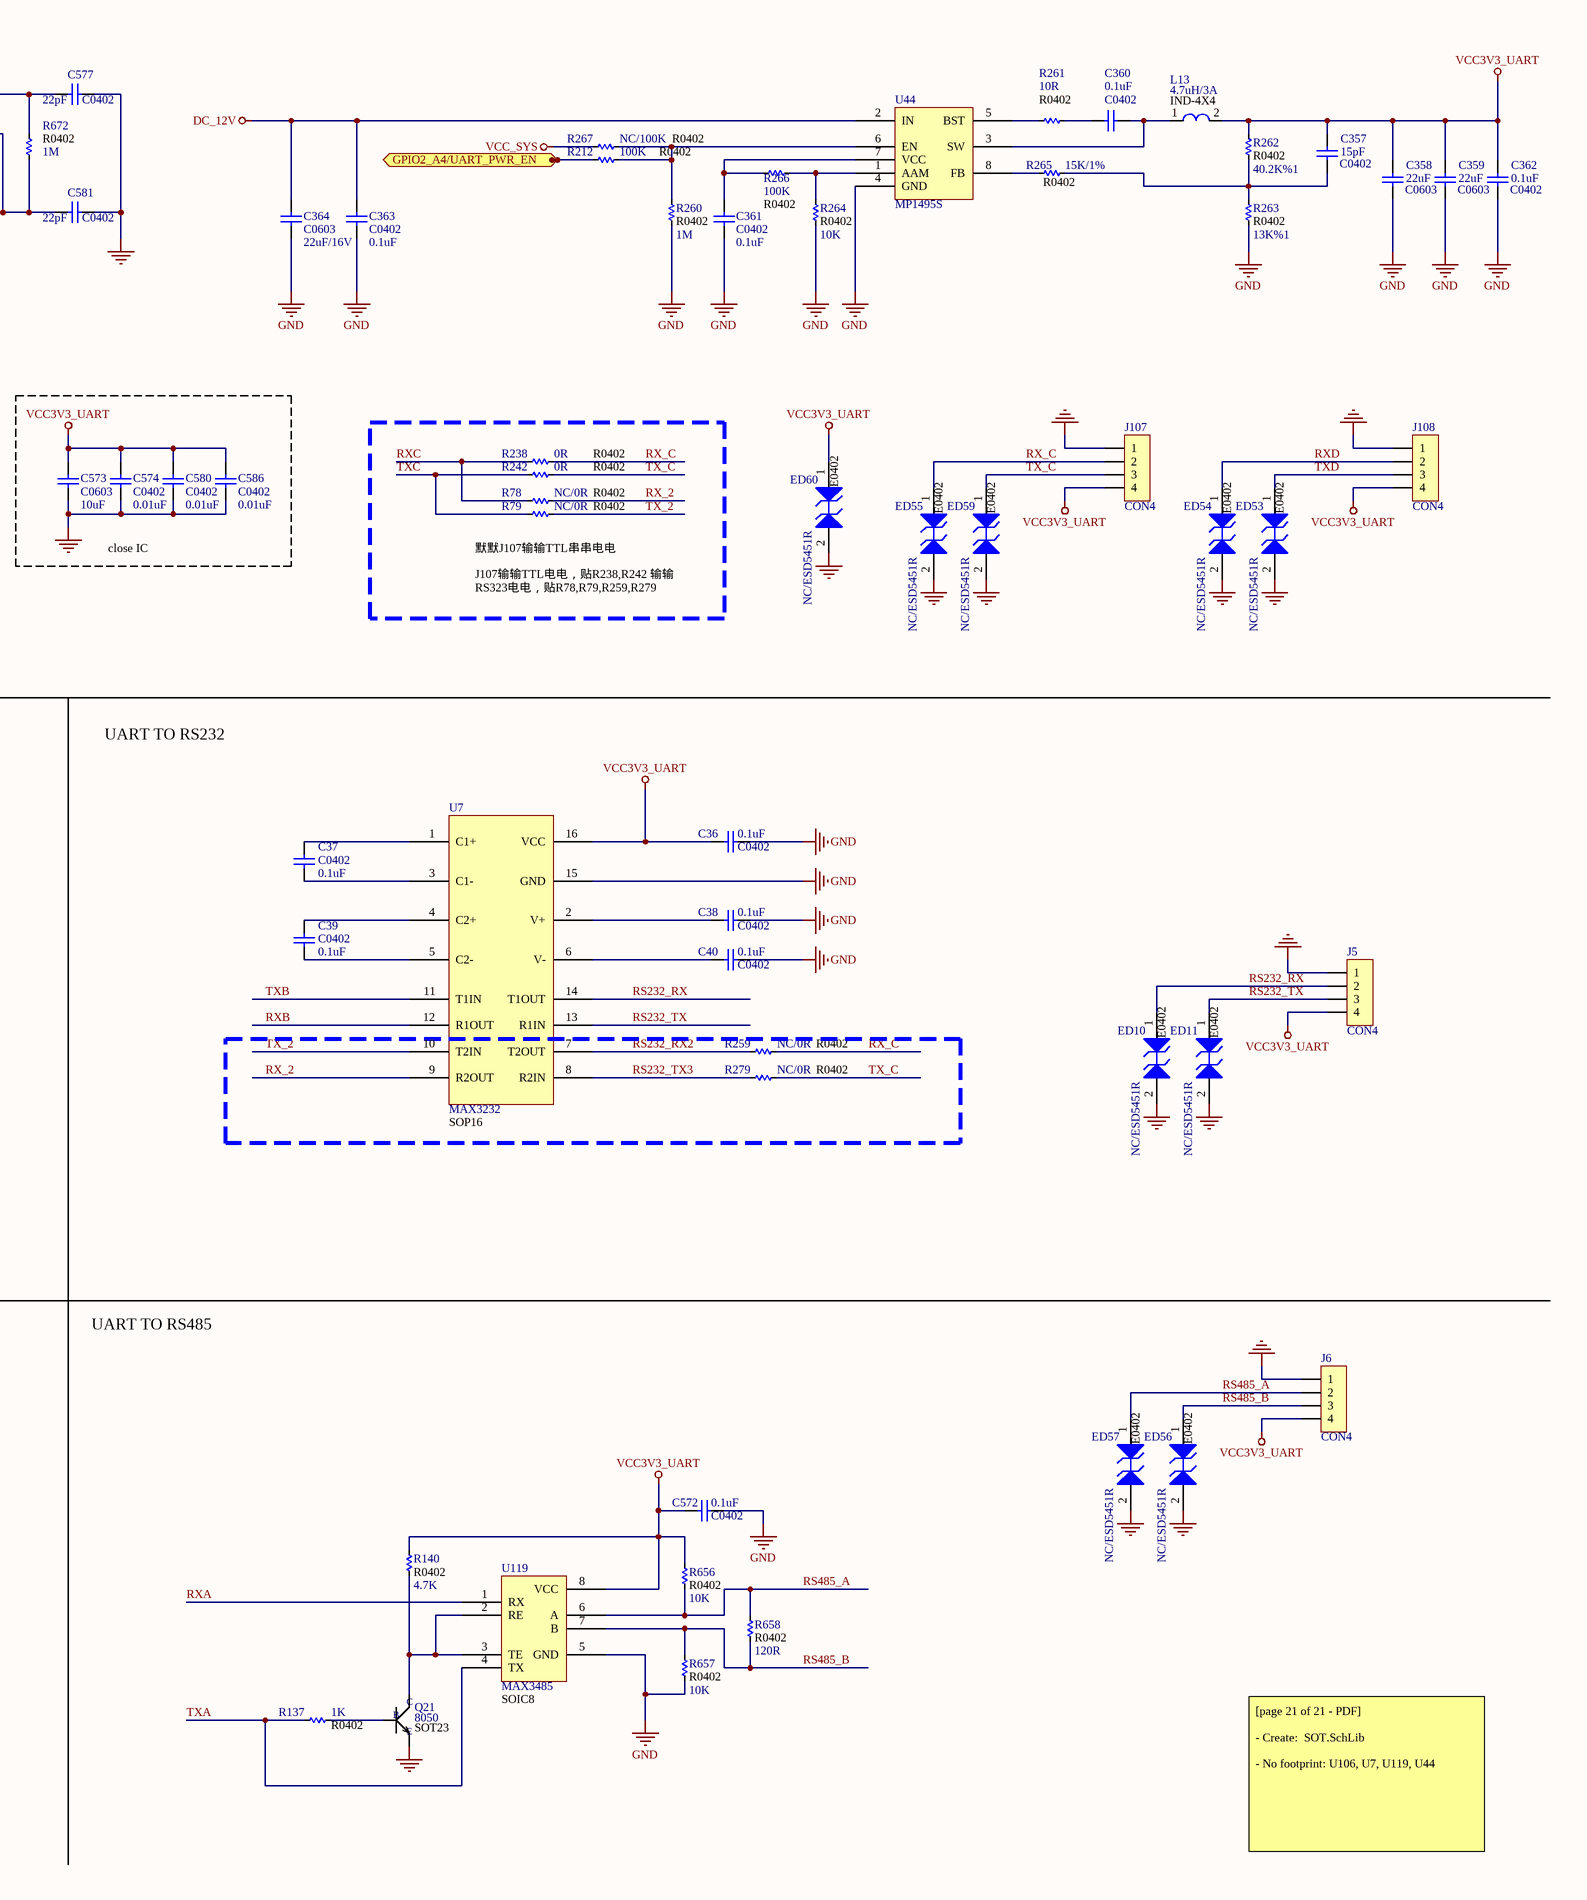
[diagram p3: SPI_UART.SchDoc, right]

### Parts
C36  C0402  value 0.1uF  [C 0402]
C37  C0402  value 0.1uF  [C 0402]
C38  C0402  value 0.1uF  [C 0402]
C39  C0402  value 0.1uF  [C 0402]
C40  C0402  value 0.1uF  [C 0402]
C106  C0402  value 100nF  [C 0402]
C107  C0603  value 10uF/10V  [C 0603]
C357  C0402  value 15pF  [C 0402]
C358  C0603  value 22uF  [C 0603]
C359  C0603  value 22uF  [C 0603]
C360  C0402  value 0.1uF  [C 0402]
C361  C0402  value 0.1uF  [C 0402]
C362  C0402  value 0.1uF  [C 0402]
C363  C0402  value 0.1uF  [C 0402]
C364  C0603  value 22uF/16V  [C 0603]
C572  C0402  value 0.1uF  [C 0402]
C573  C0603  value 10uF  [C 0603]
C574  C0402  value 0.01uF  [C 0402]
C577  C0402  value 22pF  [C 0402]
C580  C0402  value 0.01uF  [C 0402]
C581  C0402  value 22pF  [C 0402]
C585  C0402  value 22pF  [C 0402]
C586  C0402  value 0.01uF  [C 0402]
ED10  NC/ESD5451R  size: E0402  [DFN1006-2L]
ED11  NC/ESD5451R  size: E0402  [DFN1006-2L]
ED53  NC/ESD5451R  size: E0402  [DFN1006-2L]
ED54  NC/ESD5451R  size: E0402  [DFN1006-2L]
ED55  NC/ESD5451R  size: E0402  [DFN1006-2L]
ED56  NC/ESD5451R  size: E0402  [DFN1006-2L]
ED57  NC/ESD5451R  size: E0402  [DFN1006-2L]
ED59  NC/ESD5451R  size: E0402  [DFN1006-2L]
ED60  NC/ESD5451R  size: E0402  [DFN1006-2L]
J5  CON4  [CON4]
J6  CON4  [CON4]
J18  CON6_20  [Header6]
J107  CON4  [CON4]
J108  CON4  [CON4]
L13  4.7uH/3A  [L-SMD-M-7.3x4.5]
Q21  8050  [*SOT-23]
R78  R0402  value NC/0R  [R 0402]
R79  R0402  value NC/0R  [R 0402]
R137  R0402  value 1K  [R 0402]
R140  R0402  value 4.7K  [R 0402]
R212  R0402  value 100K  [R 0402]
R238  R0402  value 0R  [R 0402]
R242  R0402  value 0R  [R 0402]
R259  R0402  value NC/0R  [R 0402]
R260  R0402  value 1M  [R 0402]
R261  R0402  value 10R  [R 0402]
R262  R0402  value 40.2K%1  [R 0402]
R263  R0402  value 13K%1  [R 0402]
R264  R0402  value 10K  [R 0402]
R265  R0402  value 15K/1%  [R 0402]
R266  R0402  value 100K  [R 0402]
R267  R0402  value NC/100K  [R 0402]
R279  R0402  value NC/0R  [R 0402]
R313  R0402  value NC/0R  [R 0402]
R314  R0402  value NC/0R  [R 0402]
R656  R0402  value 10K  [R 0402]
R657  R0402  value 10K  [R 0402]
R658  R0402  value 120R  [R 0402]
R671  R0402  value 5.1K  [R 0402]
R672  R0402  value 1M  [R 0402]
R673  R0402  value 5.1K  [R 0402]
U7  MAX3232  Package: SOP16  [SOP-16]
U44  MP1495S  [TSOT-23-8]
U106  WK2124/VK3224/GM8412  [SOP-20]
U119  MAX3485  Package: SOIC8  [SOIC-8]
Y5  11.0592MHz-10ppm  [Crystal 4-SMD 32x25]

### Ports
GPIO2_A4/UART_PWR_EN (in), GPIO2_B1/SPI2_RXD (out), GPIO2_B2/SPI2_TXD (out), GPIO2_B3/SPI2_CLK (out), GPIO2_B4/SPI2_CSn0 (out), SPI1_CLK/GPIO1_B1_U (in), SPI1_CSn0/GPIO1_B2_U (in), SPI1_RXD/UART4_RX (in), SPI1_TXD/UART4_TX (in), WK2124_INT (in), WK2124_RST (in)

### Nets
DC_12V: C363.1 C364.1 U44.2(IN)
GND: C36.1 C38.1 C40.1 C106.1 C107.1 C358.1 C359.1 C361.2 C362.1 C363.2 C364.2 C572.1 C573.2 C574.2 C577.1 C580.2 C581.1 C585.1 C586.2 ED10.2(A2) ED11.2(A2) ED53.2(A2) ED54.2(A2) ED55.2(A2) ED56.2(A2) ED57.2(A2) ED59.2(A2) ED60.2(A2) J5.1 J6.1 J18.6 J107.1 J108.1 Q21.2(E) R260.2 R263.1 R264.2 R657.2 U7.15(GND) U44.4(GND) U106.1(GND1) U106.13(GND2) U119.5(GND) Y5.2(GND) Y5.4(GND)
VCC: C36.2 C357.2 C358.2 C359.2 C362.2 C572.2 C573.1 C574.1 C580.1 C586.1 ED60.1(A1) J5.4 J6.4 J107.4 J108.4 L13.2 R140.1 R262.2 R656.1 R671.2 R673.2 U7.16(VCC) U106.9(VCC1) U106.18(VCC2) U119.8(VCC)  [also labelled VCC3V3_UART]
VCC3V3_SYS: C106.2 C107.2 J18.1  [project net U27_VCC]
VCC_SYS: R267.2
RS232_RX: ED10.1(A1) J5.2 U7.14(T1OUT)
RS232_RX2: R259.2 U7.7(T2OUT)
RS232_TX: ED11.1(A1) J5.3 U7.13(R1IN)
RS232_TX3: R279.2 U7.8(R2IN)
RS485_A: ED57.1(A1) J6.2 R656.2 R658.1 U119.6(A)
RS485_B: ED56.1(A1) J6.3 R657.1 R658.2 U119.7(B)
RX_2: R78.1 U7.9(R2OUT)
RX_C: ED55.1(A1) J107.2 R238.1 R259.1
RXA: U106.15(RX1) U119.1(RX)
RXB: U7.12(R1OUT) U106.12(RX2)
RXC: R78.2 R238.2 R313.1 U106.17(RX3)
RXD: ED54.1(A1) J108.2 U106.6(RX4)
SPI1_CLK/GPIO1_B1_U: U106.3(SCLK)
SPI1_CSn0/GPIO1_B2_U: U106.2(SCS)
SPI1_RXD/UART4_RX: U106.5(SDOUT)
SPI1_TXD/UART4_TX: U106.4(SDIN)
TX_2: R79.1 U7.10(T2IN)
TX_C: ED59.1(A1) J107.3 R242.1 R279.1
TXA: R137.2 U106.14(TX1) U119.4(TX)
TXB: U7.11(T1IN) U106.11(TX2)
TXC: R79.2 R242.2 R314.1 U106.16(TX3)
TXD: ED53.1(A1) J108.3 U106.7(TX4)
WK2124_INT: R671.1 U106.10(IRQ)
NetC37_1: C37.1 U7.3(C1-)
NetC37_2: C37.2 U7.1(C1+)
NetC38_2: C38.2 U7.2(V+)
NetC39_1: C39.1 U7.5(C2-)
NetC39_2: C39.2 U7.4(C2+)
NetC40_2: C40.2 U7.6(V-)
NetC357_1: C357.1 R262.1 R263.2 R265.2
NetC360_1: C360.1 R261.2
NetC360_2: C360.2 L13.1 U44.3(SW)
NetC361_1: C361.1 R266.2 U44.7(VCC)
NetC577_2: C577.2 R672.2 U106.20(OSCO) Y5.1
NetC581_2: C581.2 R672.1 U106.19(OSCI) Y5.3
NetC585_2: C585.2 R673.1 U106.8(RST) ; port WK2124_RST
NetJ18_2: J18.2 ; port GPIO2_B3/SPI2_CLK
NetJ18_3: J18.3 ; port GPIO2_B4/SPI2_CSn0
NetJ18_4: J18.4 ; port GPIO2_B1/SPI2_RXD
NetJ18_5: J18.5 ; port GPIO2_B2/SPI2_TXD
NetJ38_73: R212.2 ; port GPIO2_A4/UART_PWR_EN
NetJ38_99: R313.2 ; port SPI1_RXD/UART4_RX
NetJ38_101: R314.2 ; port SPI1_TXD/UART4_TX
NetQ21_1: Q21.1(B) R137.1
NetQ21_3: Q21.3(C) R140.2 U119.2(RE) U119.3(TE)
NetR212_1: R212.1 R260.1 R267.1 U44.6(EN)
NetR261_1: R261.1 U44.5(BST)
NetR264_1: R264.1 R266.1 U44.1(AAM)
NetR265_1: R265.1 U44.8(FB)

### Notes on the sheet
- SPI TO UART
- close IC
- 默默J107输输TTL串串电电
  J107输输TTL电电，贴R238,R242 输输RS323电电，贴R78,R79,R259,R279
- 贴R313,R314时J107直直直直直直输输TTL电电（UART4）
- UART TO RS232
- UART TO RS485
- SPI PORT
- [page 21 of 21 - PDF]
  - Create:  SOT.SchLib
  - No footprint: U106, U7, U119, U44
- (in symbol ABM8-30.000MHZ-10-1-U-T) CRY_D3225
- (in symbol L-SMD-1) IND-4X4
- (in symbol SMD-TRANSISTORS-NPN-25V-500MW(SOT-23)) SOT23

### Library data of the parts
C36-C40 C106 C107 C357-C364 C572-C574 C577 C580 C581 C585 C586 = Cap: Capacitor; Published: 8-Jun-2000; LatestRevisionDate: 17-Jul-2002; LatestRevisionNote: Re-released for DXP Platform.; PackageReference: RAD-0.3; Publisher: Altium Limited; PackageDescription: Radial Cap, Thru-Hole; 2 Leads; 0.3 in Pin Spacing
ED10 ED11 ED53-ED57 ED59 ED60 = 1SMB54CAT3: as ED1 on sheet DC_IN; DatasheetVersion: Rev. A; PackageVersion: Rev. A, 01/2000; PackageReference: SMB-2-403C-01; PackageDescription: 2-Pin Small Molded Package, J-Bend Lead, Body 4.315 x 3.555 mm; Supplier 1: Digi-Key; Supplier Part Number 1: 1SMB54CAT3-ND; Direction: Bidirectional; Packing: Tape and Reel; Mounting Technology: Surface Mount; PartNumber: 1SMB54CAT3; ComponentLink1Description: Manufacturer URL; ComponentLink1URL: http://www.onsemi.com/; ComponentLink2Description: Datasheet; ComponentLink2URL: http://www.onsemi.com/pub_link/Collateral/1SMB10CAT3-D.PDF; ComponentLink3Description: Package Specification; ComponentLink3URL: http://www.onsemi.com/pub_link/Collateral/1SMB10CAT3-D.PDF
J5 J6 J107 J108 = JP4x1-2.0: as J2 on sheet DC_IN; Created Date: 2 April 2013; ComponentLink1URL: http://www.we-online.com; ComponentLink2URL: http://katalog.we-online.de/em/datasheet/6200xx11821.pdf; Created by: Karrer Zheng
J18 = Header 6: Header, 6-Pin; LatestRevisionDate: 17-Jul-2002; LatestRevisionNote: Re-released for DXP Platform.; Publisher: Altium Limited
L13 = L-SMD-1: as L1 on sheet DC_IN; ComponentLink1Description: Manufacturer; ComponentLink1URL: http://www.we-online.de; Created by: Baojun Chen; Created Date: Nov.2015; ComponentLink2Description: Datasheet; ComponentLink2URL: http://katalog.we-online.de/pbs/datasheet/78477010.pdf
Q21 = SMD-TRANSISTORS-NPN-25V-500MW(SOT-23): MF: Recom Power; MP: S8050; Package: SMD-8 Samsung; Price: None; SnapEDA_Link: https://www.snapeda.com/parts/S8050/Recom%20Power/view-part/?ref=snap; Availability: Unavailable; Value: *
R78 R79 R137 R140 R212 R238 R242 R259-R267 R279 R313 R314 R656-R658 R671-R673 = Res-SMD: as R1 on sheet DC_IN; Published: 08/06/2000; Publisher: Altium Hobart Technology Centre
U106 = SSOP20: Package: SSOP20
Y5 = ABM8-30.000MHZ-10-1-U-T: Ultra Miniature Crystal, SMD Ceramic, 30.000MHZ, 10pF, 10ppm@25C, 10ppm -10+60C,; MF: Abracon; SnapEDA_Link: https://www.snapeda.com/parts/ABM8-30.000MHZ-10-1-U-T/Abracon%20LLC/view-part/?ref=snap; MP: ABM8-30.000MHZ-10-1-U-T; Availability: Unavailable; Price: None; Package: SMD-4 Abracon; Value: *

## Sheet MXM_Connector.SchDoc
size D
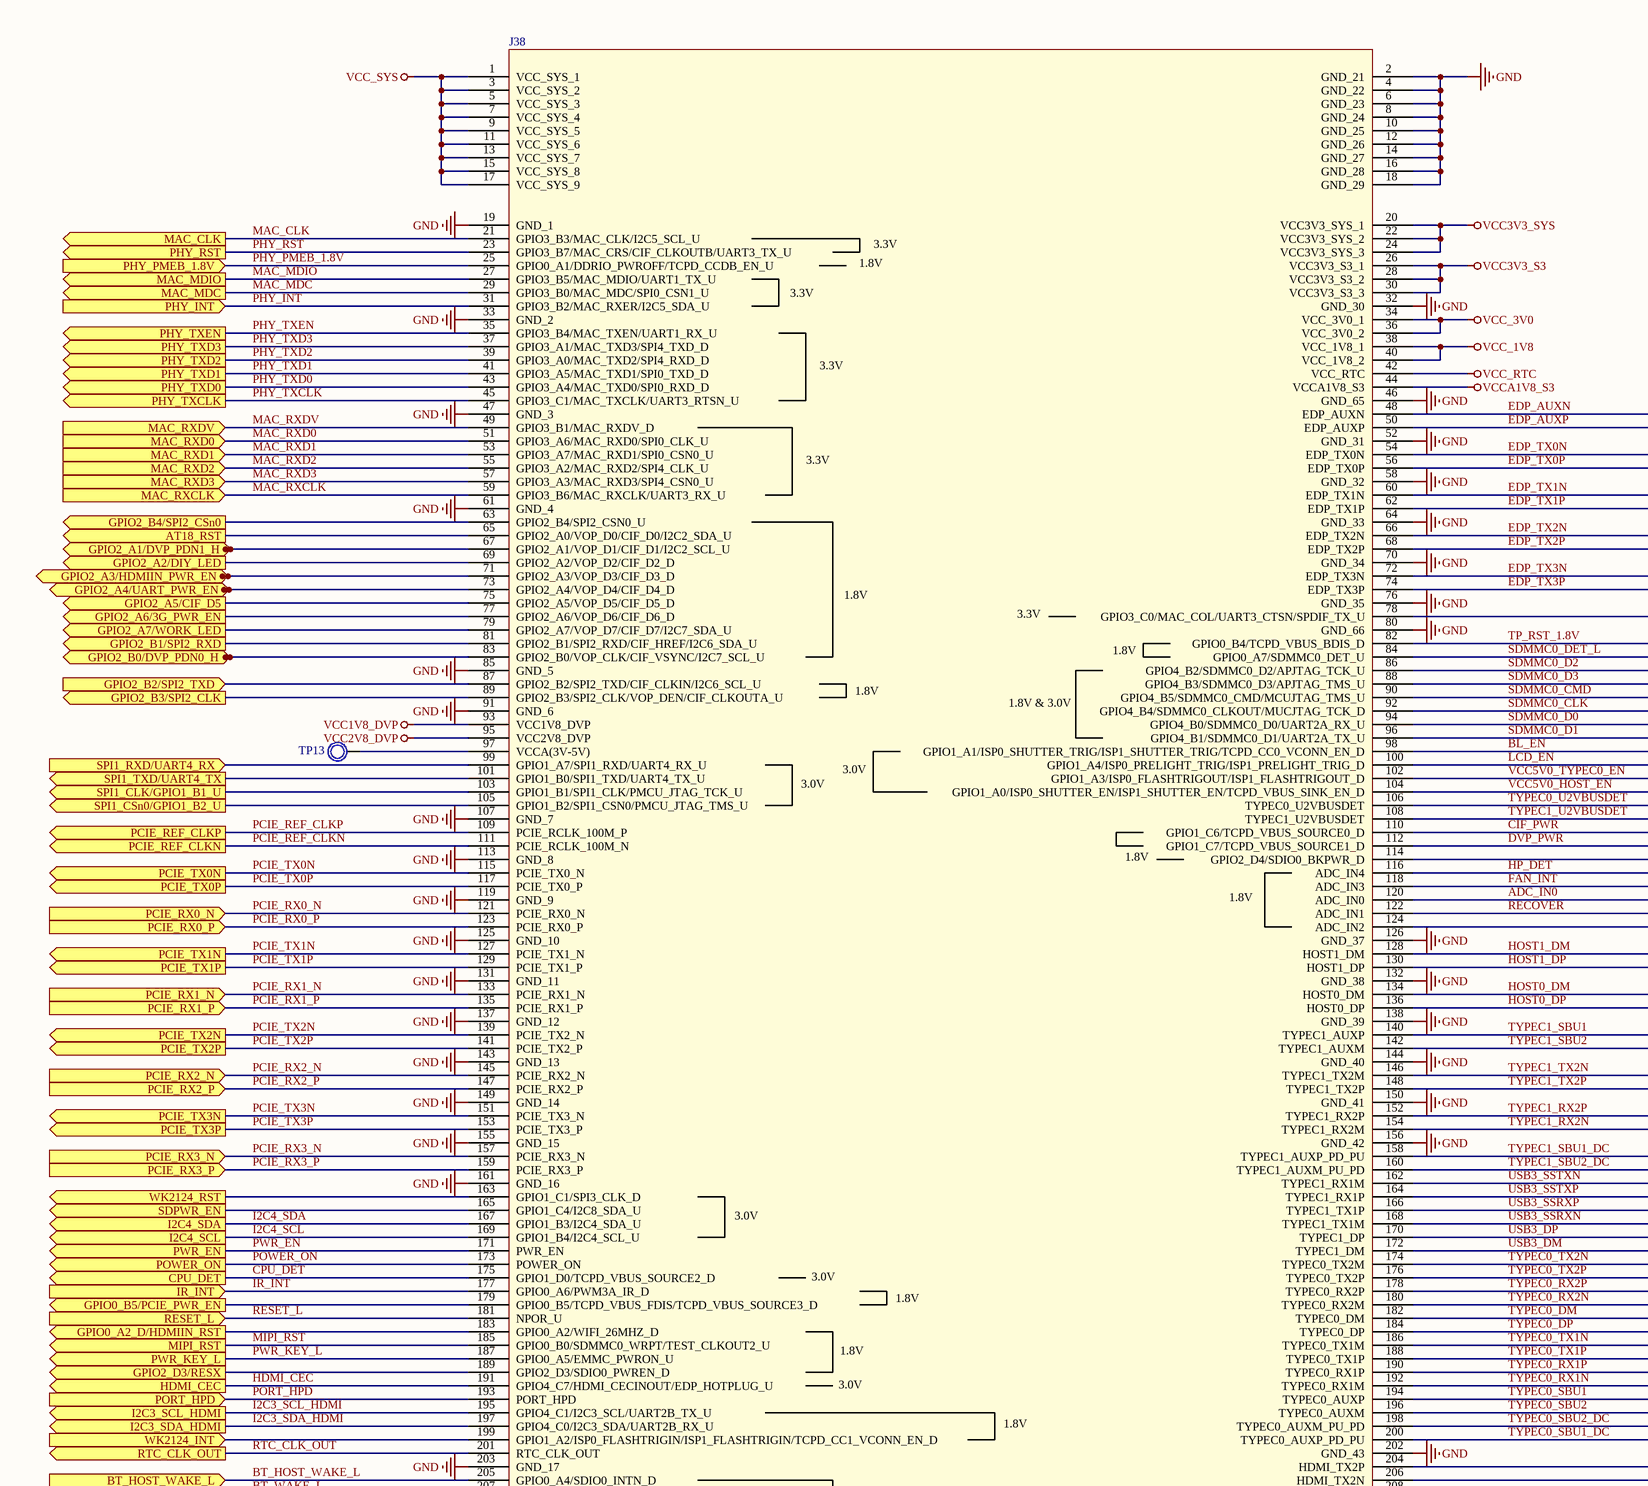
[diagram p4: MXM_Connector.SchDoc, top left]
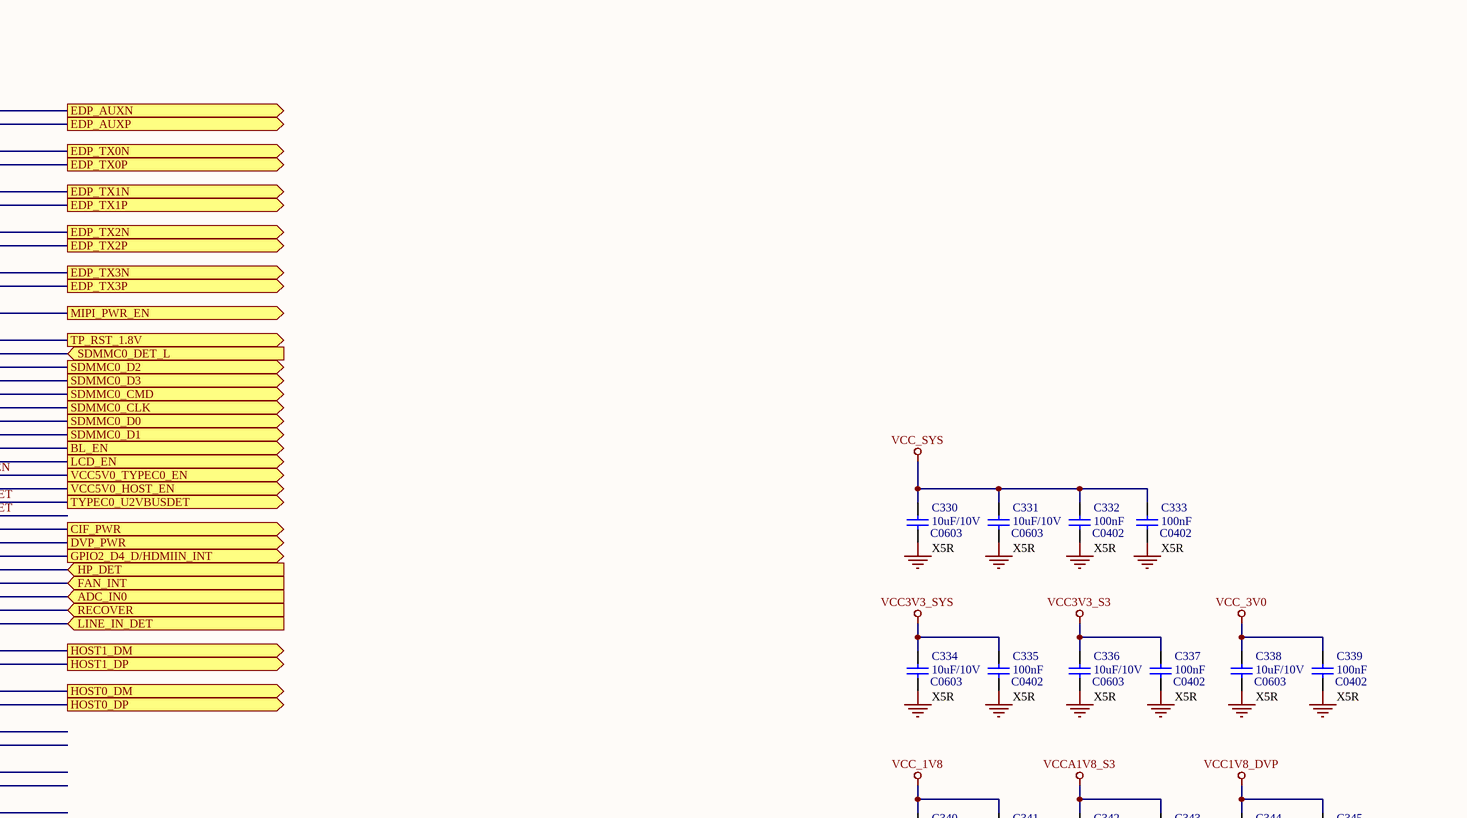
[diagram p5: MXM_Connector.SchDoc, top right]
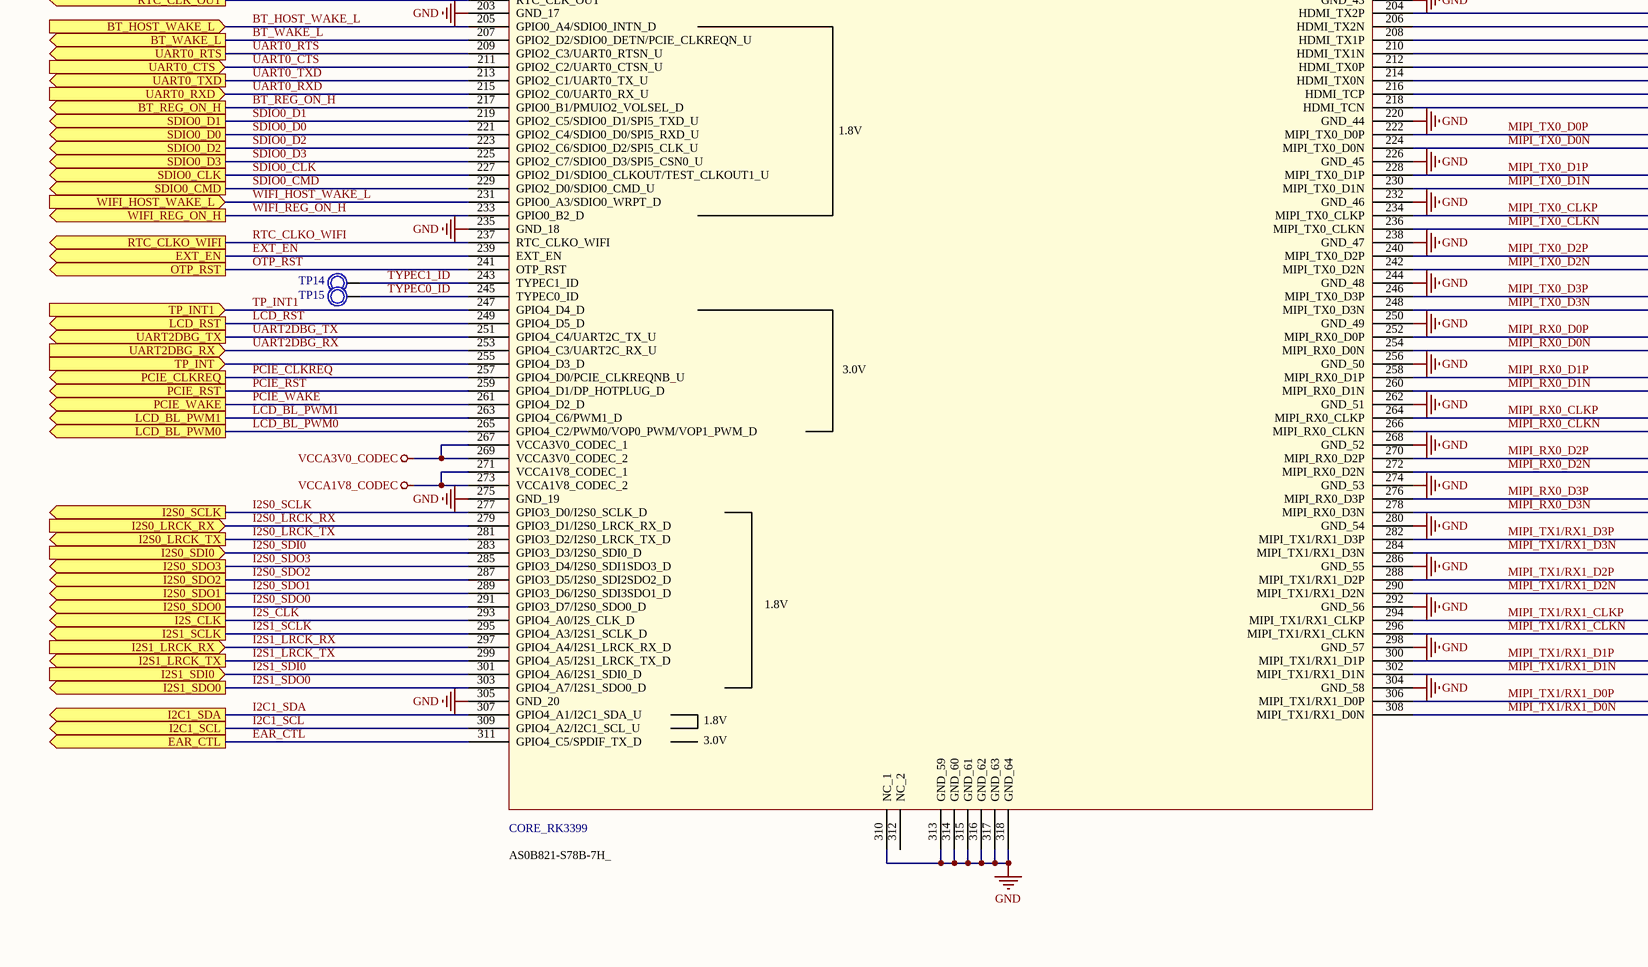
[diagram p6: MXM_Connector.SchDoc, bottom left]
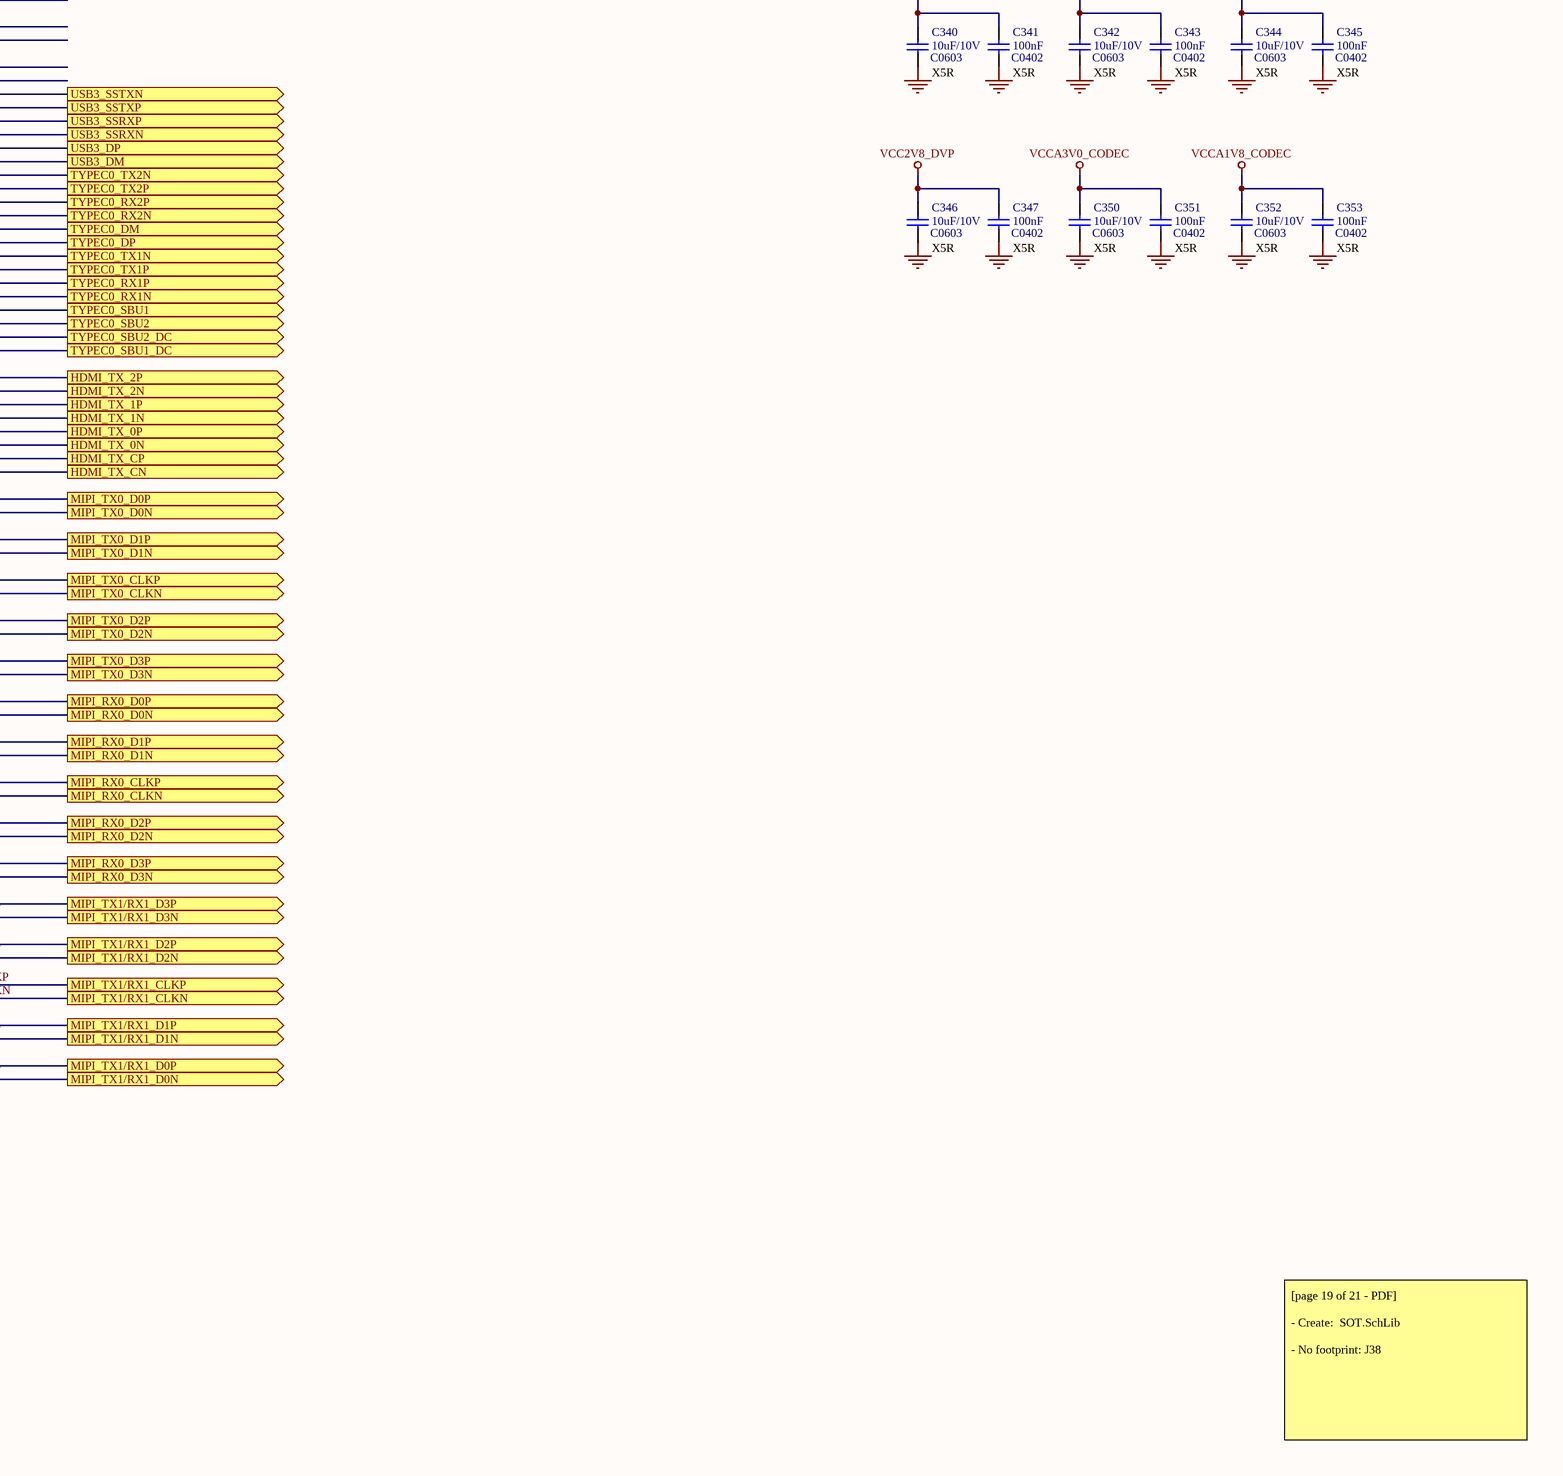
[diagram p7: MXM_Connector.SchDoc, bottom right]

### Parts
C330  C0603  value 10uF/10V  [C 0603]
C331  C0603  value 10uF/10V  [C 0603]
C332  C0402  value 100nF  [C 0402]
C333  C0402  value 100nF  [C 0402]
C334  C0603  value 10uF/10V  [C 0603]
C335  C0402  value 100nF  [C 0402]
C336  C0603  value 10uF/10V  [C 0603]
C337  C0402  value 100nF  [C 0402]
C338  C0603  value 10uF/10V  [C 0603]
C339  C0402  value 100nF  [C 0402]
C340  C0603  value 10uF/10V  [C 0603]
C341  C0402  value 100nF  [C 0402]
C342  C0603  value 10uF/10V  [C 0603]
C343  C0402  value 100nF  [C 0402]
C344  C0603  value 10uF/10V  [C 0603]
C345  C0402  value 100nF  [C 0402]
C346  C0603  value 10uF/10V  [C 0603]
C347  C0402  value 100nF  [C 0402]
C350  C0603  value 10uF/10V  [C 0603]
C351  C0402  value 100nF  [C 0402]
C352  C0603  value 10uF/10V  [C 0603]
C353  C0402  value 100nF  [C 0402]
J38  CORE_RK3399  Package: AS0B821-S78B-7H_  [*FOX_AS0B821-S78B-7H_AS0B821-S78B-7H(Primary)]
TP13  TP  [TP1]  (value not drawn)
TP14  TP  [TP1]  (value not drawn)
TP15  TP  [TP1]  (value not drawn)

### Ports
ADC_IN0 (in), AT18_RST (out), BL_EN (out), BT_HOST_WAKE_L (in), BT_REG_ON_H (out), BT_WAKE_L (out), CIF_PWR (out), CPU_DET (out), DVP_PWR (out), EAR_CTL (out), EDP_AUXN (out), EDP_AUXP (out), EDP_TX0N (out), EDP_TX0P (out), EDP_TX1N (out), EDP_TX1P (out), EDP_TX2N (out), EDP_TX2P (out), EDP_TX3N (out), EDP_TX3P (out), EXT_EN (out), FAN_INT (in), GPIO0_A2_D/HDMIIN_RST (out), GPIO0_B5/PCIE_PWR_EN (out), GPIO2_A1/DVP_PDN1_H (out), GPIO2_A2/DIY_LED (out), GPIO2_A3/HDMIIN_PWR_EN (out), GPIO2_A4/UART_PWR_EN (out), GPIO2_A5/CIF_D5 (out), GPIO2_A6/3G_PWR_EN (out), GPIO2_A7/WORK_LED (out), GPIO2_B0/DVP_PDN0_H (out), GPIO2_B1/SPI2_RXD (out), GPIO2_B2/SPI2_TXD (in), GPIO2_B3/SPI2_CLK (out), GPIO2_B4/SPI2_CSn0 (out), GPIO2_D3/RESX (out), GPIO2_D4_D/HDMIIN_INT (out), HDMI_CEC (out), HDMI_TX_0N (out), HDMI_TX_0P (out), HDMI_TX_1N (out), HDMI_TX_1P (out), HDMI_TX_2N (out), HDMI_TX_2P (out), HDMI_TX_CN (out), HDMI_TX_CP (out), HOST0_DM (out), HOST0_DP (out), HOST1_DM (out), HOST1_DP (out), HP_DET (in), I2C1_SCL (out), I2C1_SDA (out), I2C3_SCL_HDMI (out), I2C3_SDA_HDMI (out), I2C4_SCL (out), I2C4_SDA (out), I2S0_LRCK_RX (in), I2S0_LRCK_TX (out), I2S0_SCLK (out), I2S0_SDI0 (in), I2S0_SDO0 (out), I2S0_SDO1 (out), I2S0_SDO2 (out), I2S0_SDO3 (out), I2S1_LRCK_RX (in), I2S1_LRCK_TX (out), I2S1_SCLK (out), I2S1_SDI0 (in), I2S1_SDO0 (out), I2S_CLK (out), IR_INT (in), LCD_BL_PWM0 (out), LCD_BL_PWM1 (out), LCD_EN (out), LCD_RST (out), LINE_IN_DET (in), MAC_CLK (out), MAC_MDC (out), MAC_MDIO (out), MAC_RXCLK (in), MAC_RXD0 (in), MAC_RXD1 (in), MAC_RXD2 (in), MAC_RXD3 (in), MAC_RXDV (in), MIPI_PWR_EN (out), MIPI_RST (out), MIPI_RX0_CLKN (out), MIPI_RX0_CLKP (out), MIPI_RX0_D0N (out), MIPI_RX0_D0P (out), MIPI_RX0_D1N (out), MIPI_RX0_D1P (out), MIPI_RX0_D2N (out), MIPI_RX0_D2P (out), MIPI_RX0_D3N (out), MIPI_RX0_D3P (out), MIPI_TX0_CLKN (out), MIPI_TX0_CLKP (out), MIPI_TX0_D0N (out), MIPI_TX0_D0P (out), MIPI_TX0_D1N (out), MIPI_TX0_D1P (out), MIPI_TX0_D2N (out), MIPI_TX0_D2P (out), MIPI_TX0_D3N (out), MIPI_TX0_D3P (out), MIPI_TX1/RX1_CLKN (out), MIPI_TX1/RX1_CLKP (out), MIPI_TX1/RX1_D0N (out), MIPI_TX1/RX1_D0P (out), MIPI_TX1/RX1_D1N (out), MIPI_TX1/RX1_D1P (out), MIPI_TX1/RX1_D2N (out), MIPI_TX1/RX1_D2P (out), MIPI_TX1/RX1_D3N (out), MIPI_TX1/RX1_D3P (out), OTP_RST (out), PCIE_CLKREQ (out), PCIE_REF_CLKN (out), PCIE_REF_CLKP (out), PCIE_RST (out), PCIE_RX0_N (in), PCIE_RX0_P (in), PCIE_RX1_N (in), PCIE_RX1_P (in), PCIE_RX2_N (in), PCIE_RX2_P (in), PCIE_RX3_N (in), PCIE_RX3_P (in), PCIE_TX0N (out), PCIE_TX0P (out), PCIE_TX1N (out), PCIE_TX1P (out), PCIE_TX2N (out), PCIE_TX2P (out), PCIE_TX3N (out), PCIE_TX3P (out), PCIE_WAKE (out), PHY_INT (in), PHY_PMEB_1.8V (in), PHY_RST (out), PHY_TXCLK (out), PHY_TXD0 (out), PHY_TXD1 (out), PHY_TXD2 (out), PHY_TXD3 (out), PHY_TXEN (out), PORT_HPD (in), POWER_ON (out), PWR_EN (out), PWR_KEY_L (out), RECOVER (in), RESET_L (in), RTC_CLK_OUT (out), RTC_CLKO_WIFI (out), SDIO0_CLK (out), SDIO0_CMD (out), SDIO0_D0 (out), SDIO0_D1 (out), SDIO0_D2 (out), SDIO0_D3 (out), SDMMC0_CLK (out), SDMMC0_CMD (out), SDMMC0_D0 (out), SDMMC0_D1 (out), SDMMC0_D2 (out), SDMMC0_D3 (out), SDMMC0_DET_L (in), SDPWR_EN (out), SPI1_CLK/GPIO1_B1_U (out), SPI1_CSn0/GPIO1_B2_U (out), SPI1_RXD/UART4_RX (in), SPI1_TXD/UART4_TX (out), TP_INT1 (in), TP_INT (in), TP_RST_1.8V (out), TYPEC0_DM (out), TYPEC0_DP (out), TYPEC0_RX1N (out), TYPEC0_RX1P (out), TYPEC0_RX2N (out), TYPEC0_RX2P (out), TYPEC0_SBU1 (out), TYPEC0_SBU1_DC (out), TYPEC0_SBU2 (out), TYPEC0_SBU2_DC (out), TYPEC0_TX1N (out), TYPEC0_TX1P (out), TYPEC0_TX2N (out), TYPEC0_TX2P (out), TYPEC0_U2VBUSDET (out), UART0_CTS (in), UART0_RTS (out), UART0_RXD (in), UART0_TXD (out), UART2DBG_RX (in), UART2DBG_TX (out), USB3_DM (out), USB3_DP (out), USB3_SSRXN (out), USB3_SSRXP (out), USB3_SSTXN (out), USB3_SSTXP (out), VCC5V0_HOST_EN (out), VCC5V0_TYPEC0_EN (out), WIFI_HOST_WAKE_L (in), WIFI_REG_ON_H (out), WK2124_INT (in), WK2124_RST (out)

### Nets
GND: C330.2 C331.2 C332.2 C333.2 C334.2 C335.2 C336.2 C337.2 C338.2 C339.2 C340.2 C341.2 C342.2 C343.2 C344.2 C345.2 C346.2 C347.2 C350.2 C351.2 C352.2 C353.2 J38.2(GND_21) J38.4(GND_22) J38.6(GND_23) J38.8(GND_24) J38.10(GND_25) J38.12(GND_26) J38.14(GND_27) J38.16(GND_28) J38.18(GND_29) J38.19(GND_1) J38.32(GND_30) J38.33(GND_2) J38.46(GND_65) J38.47(GND_3) J38.52(GND_31) J38.58(GND_32) J38.61(GND_4) J38.64(GND_33) J38.70(GND_34) J38.76(GND_35) J38.80(GND_66) J38.85(GND_5) J38.91(GND_6) J38.107(GND_7) J38.113(GND_8) J38.119(GND_9) J38.125(GND_10) J38.126(GND_37) J38.131(GND_11) J38.132(GND_38) J38.137(GND_12) J38.138(GND_39) J38.143(GND_13) J38.144(GND_40) J38.149(GND_14) J38.150(GND_41) J38.155(GND_15) J38.156(GND_42) J38.161(GND_16) J38.202(GND_43) J38.203(GND_17) J38.220(GND_44) J38.226(GND_45) J38.232(GND_46) J38.235(GND_18) J38.238(GND_47) J38.244(GND_48) J38.250(GND_49) J38.256(GND_50) J38.262(GND_51) J38.268(GND_52) J38.274(GND_53) J38.275(GND_19) J38.280(GND_54) J38.286(GND_55) J38.292(GND_56) J38.298(GND_57) J38.304(GND_58) J38.305(GND_20) J38.310(NC_1) J38.313(GND_59) J38.314(GND_60) J38.315(GND_61) J38.316(GND_62) J38.317(GND_63) J38.318(GND_64)
VCC1V8_DVP: C344.1 C345.1 J38.93(VCC1V8_DVP)
VCC2V8_DVP: C346.1 C347.1 J38.95(VCC2V8_DVP)
VCC3V3_S3: C336.1 C337.1 J38.26(VCC3V3_S3_1) J38.28(VCC3V3_S3_2) J38.30(VCC3V3_S3_3)
VCC3V3_SYS: C334.1 C335.1 J38.20(VCC3V3_SYS_1) J38.22(VCC3V3_SYS_2) J38.24(VCC3V3_SYS_3)  [project net U27_VCC]
VCC_1V8: C340.1 C341.1 J38.38(VCC_1V8_1) J38.40(VCC_1V8_2)
VCC_3V0: C338.1 C339.1 J38.34(VCC_3V0_1) J38.36(VCC_3V0_2)
VCC_RTC: J38.42(VCC_RTC)
VCC_SYS: C330.1 C331.1 C332.1 C333.1 J38.1(VCC_SYS_1) J38.3(VCC_SYS_2) J38.5(VCC_SYS_3) J38.7(VCC_SYS_4) J38.9(VCC_SYS_5) J38.11(VCC_SYS_6) J38.13(VCC_SYS_7) J38.15(VCC_SYS_8) J38.17(VCC_SYS_9)
VCCA1V8_CODEC: C352.1 C353.1 J38.271(VCCA1V8_CODEC_1) J38.273(VCCA1V8_CODEC_2)
VCCA1V8_S3: C342.1 C343.1 J38.44(VCCA1V8_S3)
VCCA3V0_CODEC: C350.1 C351.1 J38.267(VCCA3V0_CODEC_1) J38.269(VCCA3V0_CODEC_2)
ADC_IN0: J38.120(ADC_IN0) ; port ADC_IN0
BL_EN: J38.98(GPIO1_A1/ISP0_SHUTTER_TRIG/ISP1_SHUTTER_TRIG/TCPD_CC0_VCONN_EN_D) ; port BL_EN
BT_HOST_WAKE_L: J38.205(GPIO0_A4/SDIO0_INTN_D) ; port BT_HOST_WAKE_L
BT_REG_ON_H: J38.217(GPIO0_B1/PMUIO2_VOLSEL_D) ; port BT_REG_ON_H
BT_WAKE_L: J38.207(GPIO2_D2/SDIO0_DETN/PCIE_CLKREQN_U) ; port BT_WAKE_L
CIF_PWR: J38.110(GPIO1_C6/TCPD_VBUS_SOURCE0_D) ; port CIF_PWR
CPU_DET: J38.175(GPIO1_D0/TCPD_VBUS_SOURCE2_D) ; port CPU_DET
DVP_PWR: J38.112(GPIO1_C7/TCPD_VBUS_SOURCE1_D) ; port DVP_PWR
EAR_CTL: J38.311(GPIO4_C5/SPDIF_TX_D) ; port EAR_CTL
EDP_AUXN: J38.48(EDP_AUXN) ; port EDP_AUXN
EDP_AUXP: J38.50(EDP_AUXP) ; port EDP_AUXP
EDP_TX0N: J38.54(EDP_TX0N) ; port EDP_TX0N
EDP_TX0P: J38.56(EDP_TX0P) ; port EDP_TX0P
EDP_TX1N: J38.60(EDP_TX1N) ; port EDP_TX1N
EDP_TX1P: J38.62(EDP_TX1P) ; port EDP_TX1P
EDP_TX2N: J38.66(EDP_TX2N) ; port EDP_TX2N
EDP_TX2P: J38.68(EDP_TX2P) ; port EDP_TX2P
EDP_TX3N: J38.72(EDP_TX3N) ; port EDP_TX3N
EDP_TX3P: J38.74(EDP_TX3P) ; port EDP_TX3P
EXT_EN: J38.239(EXT_EN) ; port EXT_EN
FAN_INT: J38.118(ADC_IN3) ; port FAN_INT
HDMI_CEC: J38.191(GPIO4_C7/HDMI_CECINOUT/EDP_HOTPLUG_U) ; port HDMI_CEC
HOST0_DM: J38.134(HOST0_DM) ; port HOST0_DM  [project net 3G_USB_DM]
HOST0_DP: J38.136(HOST0_DP) ; port HOST0_DP  [project net 3G_USB_DP]
HOST1_DM: J38.128(HOST1_DM) ; port HOST1_DM
HOST1_DP: J38.130(HOST1_DP) ; port HOST1_DP
HP_DET: J38.116(ADC_IN4) ; port HP_DET
I2C1_SCL: J38.309(GPIO4_A2/I2C1_SCL_U) ; port I2C1_SCL
I2C1_SDA: J38.307(GPIO4_A1/I2C1_SDA_U) ; port I2C1_SDA
I2C3_SCL_HDMI: J38.195(GPIO4_C1/I2C3_SCL/UART2B_TX_U) ; port I2C3_SCL_HDMI
I2C3_SDA_HDMI: J38.197(GPIO4_C0/I2C3_SDA/UART2B_RX_U) ; port I2C3_SDA_HDMI
I2C4_SCL: J38.169(GPIO1_B4/I2C4_SCL_U) ; port I2C4_SCL
I2C4_SDA: J38.167(GPIO1_B3/I2C4_SDA_U) ; port I2C4_SDA
I2S0_LRCK_RX: J38.279(GPIO3_D1/I2S0_LRCK_RX_D) ; port I2S0_LRCK_RX
I2S0_LRCK_TX: J38.281(GPIO3_D2/I2S0_LRCK_TX_D) ; port I2S0_LRCK_TX
I2S0_SCLK: J38.277(GPIO3_D0/I2S0_SCLK_D) ; port I2S0_SCLK
I2S0_SDI0: J38.283(GPIO3_D3/I2S0_SDI0_D) ; port I2S0_SDI0
I2S0_SDO0: J38.291(GPIO3_D7/I2S0_SDO0_D) ; port I2S0_SDO0
I2S0_SDO1: J38.289(GPIO3_D6/I2S0_SDI3SDO1_D) ; port I2S0_SDO1
I2S0_SDO2: J38.287(GPIO3_D5/I2S0_SDI2SDO2_D) ; port I2S0_SDO2
I2S0_SDO3: J38.285(GPIO3_D4/I2S0_SDI1SDO3_D) ; port I2S0_SDO3
I2S1_LRCK_RX: J38.297(GPIO4_A4/I2S1_LRCK_RX_D) ; port I2S1_LRCK_RX
I2S1_LRCK_TX: J38.299(GPIO4_A5/I2S1_LRCK_TX_D) ; port I2S1_LRCK_TX
I2S1_SCLK: J38.295(GPIO4_A3/I2S1_SCLK_D) ; port I2S1_SCLK
I2S1_SDI0: J38.301(GPIO4_A6/I2S1_SDI0_D) ; port I2S1_SDI0
I2S1_SDO0: J38.303(GPIO4_A7/I2S1_SDO0_D) ; port I2S1_SDO0
I2S_CLK: J38.293(GPIO4_A0/I2S_CLK_D) ; port I2S_CLK
IR_INT: J38.177(GPIO0_A6/PWM3A_IR_D) ; port IR_INT
LCD_BL_PWM0: J38.265(GPIO4_C2/PWM0/VOP0_PWM/VOP1_PWM_D) ; port LCD_BL_PWM0
LCD_BL_PWM1: J38.263(GPIO4_C6/PWM1_D) ; port LCD_BL_PWM1
LCD_EN: J38.100(GPIO1_A4/ISP0_PRELIGHT_TRIG/ISP1_PRELIGHT_TRIG_D) ; port LCD_EN
LCD_RST: J38.249(GPIO4_D5_D) ; port LCD_RST
MAC_CLK: J38.21(GPIO3_B3/MAC_CLK/I2C5_SCL_U) ; port MAC_CLK
MAC_MDC: J38.29(GPIO3_B0/MAC_MDC/SPI0_CSN1_U) ; port MAC_MDC
MAC_MDIO: J38.27(GPIO3_B5/MAC_MDIO/UART1_TX_U) ; port MAC_MDIO
MAC_RXCLK: J38.59(GPIO3_B6/MAC_RXCLK/UART3_RX_U) ; port MAC_RXCLK
MAC_RXD0: J38.51(GPIO3_A6/MAC_RXD0/SPI0_CLK_U) ; port MAC_RXD0
MAC_RXD1: J38.53(GPIO3_A7/MAC_RXD1/SPI0_CSN0_U) ; port MAC_RXD1
MAC_RXD2: J38.55(GPIO3_A2/MAC_RXD2/SPI4_CLK_U) ; port MAC_RXD2
MAC_RXD3: J38.57(GPIO3_A3/MAC_RXD3/SPI4_CSN0_U) ; port MAC_RXD3
MAC_RXDV: J38.49(GPIO3_B1/MAC_RXDV_D) ; port MAC_RXDV
MIPI_RST: J38.185(GPIO0_B0/SDMMC0_WRPT/TEST_CLKOUT2_U) ; port MIPI_RST
MIPI_RX0_CLKN: J38.266(MIPI_RX0_CLKN) ; port MIPI_RX0_CLKN
MIPI_RX0_CLKP: J38.264(MIPI_RX0_CLKP) ; port MIPI_RX0_CLKP
MIPI_RX0_D0N: J38.254(MIPI_RX0_D0N) ; port MIPI_RX0_D0N
MIPI_RX0_D0P: J38.252(MIPI_RX0_D0P) ; port MIPI_RX0_D0P
MIPI_RX0_D1N: J38.260(MIPI_RX0_D1N) ; port MIPI_RX0_D1N
MIPI_RX0_D1P: J38.258(MIPI_RX0_D1P) ; port MIPI_RX0_D1P
MIPI_RX0_D2N: J38.272(MIPI_RX0_D2N) ; port MIPI_RX0_D2N
MIPI_RX0_D2P: J38.270(MIPI_RX0_D2P) ; port MIPI_RX0_D2P
MIPI_RX0_D3N: J38.278(MIPI_RX0_D3N) ; port MIPI_RX0_D3N
MIPI_RX0_D3P: J38.276(MIPI_RX0_D3P) ; port MIPI_RX0_D3P
MIPI_TX0_CLKN: J38.236(MIPI_TX0_CLKN) ; port MIPI_TX0_CLKN
MIPI_TX0_CLKP: J38.234(MIPI_TX0_CLKP) ; port MIPI_TX0_CLKP
MIPI_TX0_D0N: J38.224(MIPI_TX0_D0N) ; port MIPI_TX0_D0N
MIPI_TX0_D0P: J38.222(MIPI_TX0_D0P) ; port MIPI_TX0_D0P
MIPI_TX0_D1N: J38.230(MIPI_TX0_D1N) ; port MIPI_TX0_D1N
MIPI_TX0_D1P: J38.228(MIPI_TX0_D1P) ; port MIPI_TX0_D1P
MIPI_TX0_D2N: J38.242(MIPI_TX0_D2N) ; port MIPI_TX0_D2N
MIPI_TX0_D2P: J38.240(MIPI_TX0_D2P) ; port MIPI_TX0_D2P
MIPI_TX0_D3N: J38.248(MIPI_TX0_D3N) ; port MIPI_TX0_D3N
MIPI_TX0_D3P: J38.246(MIPI_TX0_D3P) ; port MIPI_TX0_D3P
MIPI_TX1/RX1_CLKN: J38.296(MIPI_TX1/RX1_CLKN) ; port MIPI_TX1/RX1_CLKN
MIPI_TX1/RX1_CLKP: J38.294(MIPI_TX1/RX1_CLKP) ; port MIPI_TX1/RX1_CLKP
MIPI_TX1/RX1_D0N: J38.308(MIPI_TX1/RX1_D0N) ; port MIPI_TX1/RX1_D0N
MIPI_TX1/RX1_D0P: J38.306(MIPI_TX1/RX1_D0P) ; port MIPI_TX1/RX1_D0P
MIPI_TX1/RX1_D1N: J38.302(MIPI_TX1/RX1_D1N) ; port MIPI_TX1/RX1_D1N
MIPI_TX1/RX1_D1P: J38.300(MIPI_TX1/RX1_D1P) ; port MIPI_TX1/RX1_D1P
MIPI_TX1/RX1_D2N: J38.290(MIPI_TX1/RX1_D2N) ; port MIPI_TX1/RX1_D2N
MIPI_TX1/RX1_D2P: J38.288(MIPI_TX1/RX1_D2P) ; port MIPI_TX1/RX1_D2P
MIPI_TX1/RX1_D3N: J38.284(MIPI_TX1/RX1_D3N) ; port MIPI_TX1/RX1_D3N
MIPI_TX1/RX1_D3P: J38.282(MIPI_TX1/RX1_D3P) ; port MIPI_TX1/RX1_D3P
OTP_RST: J38.241(OTP_RST) ; port OTP_RST
PCIE_CLKREQ: J38.257(GPIO4_D0/PCIE_CLKREQNB_U) ; port PCIE_CLKREQ
PCIE_REF_CLKN: J38.111(PCIE_RCLK_100M_N) ; port PCIE_REF_CLKN
PCIE_REF_CLKP: J38.109(PCIE_RCLK_100M_P) ; port PCIE_REF_CLKP
PCIE_RST: J38.259(GPIO4_D1/DP_HOTPLUG_D) ; port PCIE_RST
PCIE_RX0_N: J38.121(PCIE_RX0_N) ; port PCIE_RX0_N
PCIE_RX0_P: J38.123(PCIE_RX0_P) ; port PCIE_RX0_P
PCIE_RX1_N: J38.133(PCIE_RX1_N) ; port PCIE_RX1_N
PCIE_RX1_P: J38.135(PCIE_RX1_P) ; port PCIE_RX1_P
PCIE_RX2_N: J38.145(PCIE_RX2_N) ; port PCIE_RX2_N
PCIE_RX2_P: J38.147(PCIE_RX2_P) ; port PCIE_RX2_P
PCIE_RX3_N: J38.157(PCIE_RX3_N) ; port PCIE_RX3_N
PCIE_RX3_P: J38.159(PCIE_RX3_P) ; port PCIE_RX3_P
PCIE_TX0N: J38.115(PCIE_TX0_N) ; port PCIE_TX0N
PCIE_TX0P: J38.117(PCIE_TX0_P) ; port PCIE_TX0P
PCIE_TX1N: J38.127(PCIE_TX1_N) ; port PCIE_TX1N
PCIE_TX1P: J38.129(PCIE_TX1_P) ; port PCIE_TX1P
PCIE_TX2N: J38.139(PCIE_TX2_N) ; port PCIE_TX2N
PCIE_TX2P: J38.141(PCIE_TX2_P) ; port PCIE_TX2P
PCIE_TX3N: J38.151(PCIE_TX3_N) ; port PCIE_TX3N
PCIE_TX3P: J38.153(PCIE_TX3_P) ; port PCIE_TX3P
PCIE_WAKE: J38.261(GPIO4_D2_D) ; port PCIE_WAKE
PHY_INT: J38.31(GPIO3_B2/MAC_RXER/I2C5_SDA_U) ; port PHY_INT
PHY_PMEB_1.8V: J38.25(GPIO0_A1/DDRIO_PWROFF/TCPD_CCDB_EN_U) ; port PHY_PMEB_1.8V
PHY_RST: J38.23(GPIO3_B7/MAC_CRS/CIF_CLKOUTB/UART3_TX_U) ; port PHY_RST
PHY_TXCLK: J38.45(GPIO3_C1/MAC_TXCLK/UART3_RTSN_U) ; port PHY_TXCLK
PHY_TXD0: J38.43(GPIO3_A4/MAC_TXD0/SPI0_RXD_D) ; port PHY_TXD0
PHY_TXD1: J38.41(GPIO3_A5/MAC_TXD1/SPI0_TXD_D) ; port PHY_TXD1
PHY_TXD2: J38.39(GPIO3_A0/MAC_TXD2/SPI4_RXD_D) ; port PHY_TXD2
PHY_TXD3: J38.37(GPIO3_A1/MAC_TXD3/SPI4_TXD_D) ; port PHY_TXD3
PHY_TXEN: J38.35(GPIO3_B4/MAC_TXEN/UART1_RX_U) ; port PHY_TXEN
PORT_HPD: J38.193(PORT_HPD) ; port PORT_HPD
POWER_ON: J38.173(POWER_ON) ; port POWER_ON
PWR_EN: J38.171(PWR_EN) ; port PWR_EN
PWR_KEY_L: J38.187(GPIO0_A5/EMMC_PWRON_U) ; port PWR_KEY_L
RECOVER: J38.122(ADC_IN1) ; port RECOVER
RESET_L: J38.181(NPOR_U) ; port RESET_L
RTC_CLK_OUT: J38.201(RTC_CLK_OUT) ; port RTC_CLK_OUT
RTC_CLKO_WIFI: J38.237(RTC_CLKO_WIFI) ; port RTC_CLKO_WIFI
SDIO0_CLK: J38.227(GPIO2_D1/SDIO0_CLKOUT/TEST_CLKOUT1_U) ; port SDIO0_CLK
SDIO0_CMD: J38.229(GPIO2_D0/SDIO0_CMD_U) ; port SDIO0_CMD
SDIO0_D0: J38.221(GPIO2_C4/SDIO0_D0/SPI5_RXD_U) ; port SDIO0_D0
SDIO0_D1: J38.219(GPIO2_C5/SDIO0_D1/SPI5_TXD_U) ; port SDIO0_D1
SDIO0_D2: J38.223(GPIO2_C6/SDIO0_D2/SPI5_CLK_U) ; port SDIO0_D2
SDIO0_D3: J38.225(GPIO2_C7/SDIO0_D3/SPI5_CSN0_U) ; port SDIO0_D3
SDMMC0_CLK: J38.92(GPIO4_B4/SDMMC0_CLKOUT/MUCJTAG_TCK_D) ; port SDMMC0_CLK
SDMMC0_CMD: J38.90(GPIO4_B5/SDMMC0_CMD/MCUJTAG_TMS_U) ; port SDMMC0_CMD
SDMMC0_D0: J38.94(GPIO4_B0/SDMMC0_D0/UART2A_RX_U) ; port SDMMC0_D0
SDMMC0_D1: J38.96(GPIO4_B1/SDMMC0_D1/UART2A_TX_U) ; port SDMMC0_D1
SDMMC0_D2: J38.86(GPIO4_B2/SDMMC0_D2/APJTAG_TCK_U) ; port SDMMC0_D2
SDMMC0_D3: J38.88(GPIO4_B3/SDMMC0_D3/APJTAG_TMS_U) ; port SDMMC0_D3
SDMMC0_DET_L: J38.84(GPIO0_A7/SDMMC0_DET_U) ; port SDMMC0_DET_L
TP_INT1: J38.247(GPIO4_D4_D) ; port TP_INT1
TP_RST_1.8V: J38.82(GPIO0_B4/TCPD_VBUS_BDIS_D) ; port TP_RST_1.8V
TYPEC0_DM: J38.182(TYPEC0_DM) ; port TYPEC0_DM
TYPEC0_DP: J38.184(TYPEC0_DP) ; port TYPEC0_DP
TYPEC0_ID: J38.245(TYPEC0_ID) TP15.1
TYPEC0_RX1N: J38.192(TYPEC0_RX1M) ; port TYPEC0_RX1N
TYPEC0_RX1P: J38.190(TYPEC0_RX1P) ; port TYPEC0_RX1P
TYPEC0_RX2N: J38.180(TYPEC0_RX2M) ; port TYPEC0_RX2N
TYPEC0_RX2P: J38.178(TYPEC0_RX2P) ; port TYPEC0_RX2P
TYPEC0_SBU1: J38.194(TYPEC0_AUXP) ; port TYPEC0_SBU1
TYPEC0_SBU1_DC: J38.200(TYPEC0_AUXP_PD_PU) ; port TYPEC0_SBU1_DC
TYPEC0_SBU2: J38.196(TYPEC0_AUXM) ; port TYPEC0_SBU2
TYPEC0_SBU2_DC: J38.198(TYPEC0_AUXM_PU_PD) ; port TYPEC0_SBU2_DC
TYPEC0_TX1N: J38.186(TYPEC0_TX1M) ; port TYPEC0_TX1N
TYPEC0_TX1P: J38.188(TYPEC0_TX1P) ; port TYPEC0_TX1P
TYPEC0_TX2N: J38.174(TYPEC0_TX2M) ; port TYPEC0_TX2N
TYPEC0_TX2P: J38.176(TYPEC0_TX2P) ; port TYPEC0_TX2P
TYPEC0_U2VBUSDET: J38.106(TYPEC0_U2VBUSDET) ; port TYPEC0_U2VBUSDET
TYPEC1_ID: J38.243(TYPEC1_ID) TP14.1
TYPEC1_RX2N: J38.154(TYPEC1_RX2M)
TYPEC1_RX2P: J38.152(TYPEC1_RX2P)
TYPEC1_SBU1: J38.140(TYPEC1_AUXP)
TYPEC1_SBU1_DC: J38.158(TYPEC1_AUXP_PD_PU)
TYPEC1_SBU2: J38.142(TYPEC1_AUXM)
TYPEC1_SBU2_DC: J38.160(TYPEC1_AUXM_PU_PD)
TYPEC1_TX2N: J38.146(TYPEC1_TX2M)
TYPEC1_TX2P: J38.148(TYPEC1_TX2P)
TYPEC1_U2VBUSDET: J38.108(TYPEC1_U2VBUSDET)
UART0_CTS: J38.211(GPIO2_C2/UART0_CTSN_U) ; port UART0_CTS
UART0_RTS: J38.209(GPIO2_C3/UART0_RTSN_U) ; port UART0_RTS
UART0_RXD: J38.215(GPIO2_C0/UART0_RX_U) ; port UART0_RXD
UART0_TXD: J38.213(GPIO2_C1/UART0_TX_U) ; port UART0_TXD
UART2DBG_RX: J38.253(GPIO4_C3/UART2C_RX_U) ; port UART2DBG_RX
UART2DBG_TX: J38.251(GPIO4_C4/UART2C_TX_U) ; port UART2DBG_TX
USB3_DM: J38.172(TYPEC1_DM) ; port USB3_DM
USB3_DP: J38.170(TYPEC1_DP) ; port USB3_DP
USB3_SSRXN: J38.168(TYPEC1_TX1M) ; port USB3_SSRXN
USB3_SSRXP: J38.166(TYPEC1_TX1P) ; port USB3_SSRXP
USB3_SSTXN: J38.162(TYPEC1_RX1M) ; port USB3_SSTXN
USB3_SSTXP: J38.164(TYPEC1_RX1P) ; port USB3_SSTXP
VCC5V0_HOST_EN: J38.104(GPIO1_A0/ISP0_SHUTTER_EN/ISP1_SHUTTER_EN/TCPD_VBUS_SINK_EN_D) ; port VCC5V0_HOST_EN
VCC5V0_TYPEC0_EN: J38.102(GPIO1_A3/ISP0_FLASHTRIGOUT/ISP1_FLASHTRIGOUT_D) ; port VCC5V0_TYPEC0_EN
WIFI_HOST_WAKE_L: J38.231(GPIO0_A3/SDIO0_WRPT_D) ; port WIFI_HOST_WAKE_L
WIFI_REG_ON_H: J38.233(GPIO0_B2_D) ; port WIFI_REG_ON_H
NetC585_2: J38.163(GPIO1_C1/SPI3_CLK_D) ; port WK2124_RST
NetJ18_2: J38.89(GPIO2_B3/SPI2_CLK/VOP_DEN/CIF_CLKOUTA_U) ; port GPIO2_B3/SPI2_CLK
NetJ18_3: J38.63(GPIO2_B4/SPI2_CSN0_U) ; port GPIO2_B4/SPI2_CSn0
NetJ18_4: J38.81(GPIO2_B1/SPI2_RXD/CIF_HREF/I2C6_SDA_U) ; port GPIO2_B1/SPI2_RXD
NetJ18_5: J38.87(GPIO2_B2/SPI2_TXD/CIF_CLKIN/I2C6_SCL_U) ; port GPIO2_B2/SPI2_TXD
NetJ19_7: J38.67(GPIO2_A1/VOP_D1/CIF_D1/I2C2_SCL_U) ; port GPIO2_A1/DVP_PDN1_H
NetJ24_2: J38.255(GPIO4_D3_D) ; port TP_INT
NetJ32_7: J38.83(GPIO2_B0/VOP_CLK/CIF_VSYNC/I2C7_SCL_U) ; port GPIO2_B0/DVP_PDN0_H
NetJ38_65: J38.65(GPIO2_A0/VOP_D0/CIF_D0/I2C2_SDA_U) ; port AT18_RST
NetJ38_69: J38.69(GPIO2_A2/VOP_D2/CIF_D2_D) ; port GPIO2_A2/DIY_LED
NetJ38_71: J38.71(GPIO2_A3/VOP_D3/CIF_D3_D) ; port GPIO2_A3/HDMIIN_PWR_EN
NetJ38_73: J38.73(GPIO2_A4/VOP_D4/CIF_D4_D) ; port GPIO2_A4/UART_PWR_EN
NetJ38_75: J38.75(GPIO2_A5/VOP_D5/CIF_D5_D) ; port GPIO2_A5/CIF_D5
NetJ38_77: J38.77(GPIO2_A6/VOP_D6/CIF_D6_D) ; port GPIO2_A6/3G_PWR_EN
NetJ38_78: J38.78(GPIO3_C0/MAC_COL/UART3_CTSN/SPDIF_TX_U) ; port MIPI_PWR_EN
NetJ38_79: J38.79(GPIO2_A7/VOP_D7/CIF_D7/I2C7_SDA_U) ; port GPIO2_A7/WORK_LED
NetJ38_97: J38.97(VCCA(3V-5V)) TP13.1
NetJ38_99: J38.99(GPIO1_A7/SPI1_RXD/UART4_RX_U) ; port SPI1_RXD/UART4_RX
NetJ38_101: J38.101(GPIO1_B0/SPI1_TXD/UART4_TX_U) ; port SPI1_TXD/UART4_TX
NetJ38_103: J38.103(GPIO1_B1/SPI1_CLK/PMCU_JTAG_TCK_U) ; port SPI1_CLK/GPIO1_B1_U
NetJ38_105: J38.105(GPIO1_B2/SPI1_CSN0/PMCU_JTAG_TMS_U) ; port SPI1_CSn0/GPIO1_B2_U
NetJ38_114: J38.114(GPIO2_D4/SDIO0_BKPWR_D) ; port GPIO2_D4_D/HDMIIN_INT
NetJ38_124: J38.124(ADC_IN2) ; port LINE_IN_DET
NetJ38_165: J38.165(GPIO1_C4/I2C8_SDA_U) ; port SDPWR_EN
NetJ38_179: J38.179(GPIO0_B5/TCPD_VBUS_FDIS/TCPD_VBUS_SOURCE3_D) ; port GPIO0_B5/PCIE_PWR_EN
NetJ38_183: J38.183(GPIO0_A2/WIFI_26MHZ_D) ; port GPIO0_A2_D/HDMIIN_RST
NetJ38_189: J38.189(GPIO2_D3/SDIO0_PWREN_D) ; port GPIO2_D3/RESX
NetJ38_199: J38.199(GPIO1_A2/ISP0_FLASHTRIGIN/ISP1_FLASHTRIGIN/TCPD_CC1_VCONN_EN_D) ; port WK2124_INT
NetJ38_204: J38.204(HDMI_TX2P) ; port HDMI_TX_2P
NetJ38_206: J38.206(HDMI_TX2N) ; port HDMI_TX_2N
NetJ38_208: J38.208(HDMI_TX1P) ; port HDMI_TX_1P
NetJ38_210: J38.210(HDMI_TX1N) ; port HDMI_TX_1N
NetJ38_212: J38.212(HDMI_TX0P) ; port HDMI_TX_0P
NetJ38_214: J38.214(HDMI_TX0N) ; port HDMI_TX_0N
NetJ38_216: J38.216(HDMI_TCP) ; port HDMI_TX_CP
NetJ38_218: J38.218(HDMI_TCN) ; port HDMI_TX_CN

Not connected (* = marked no-connect by the designer): J38 312(NC_2)

### Notes on the sheet
- [page 19 of 21 - PDF]
  - Create:  SOT.SchLib
  - No footprint: J38
- (in symbol Cap) X5R
- (in symbol CORE_RK3399) 3.3V; 1.8V; 1.8V & 3.0V; 3.0V

### Library data of the parts
C330-C347 C350-C353 = Cap: Capacitor; Published: 8-Jun-2000; LatestRevisionDate: 17-Jul-2002; LatestRevisionNote: Re-released for DXP Platform.; PackageReference: RAD-0.3; Publisher: Altium Limited; PackageDescription: Radial Cap, Thru-Hole; 2 Leads; 0.3 in Pin Spacing
TP13-TP15 = TP1: Test Point; Value: Test Point